# EAGLE board a3640 (EAGLE 7.7.0), part 1 of 11
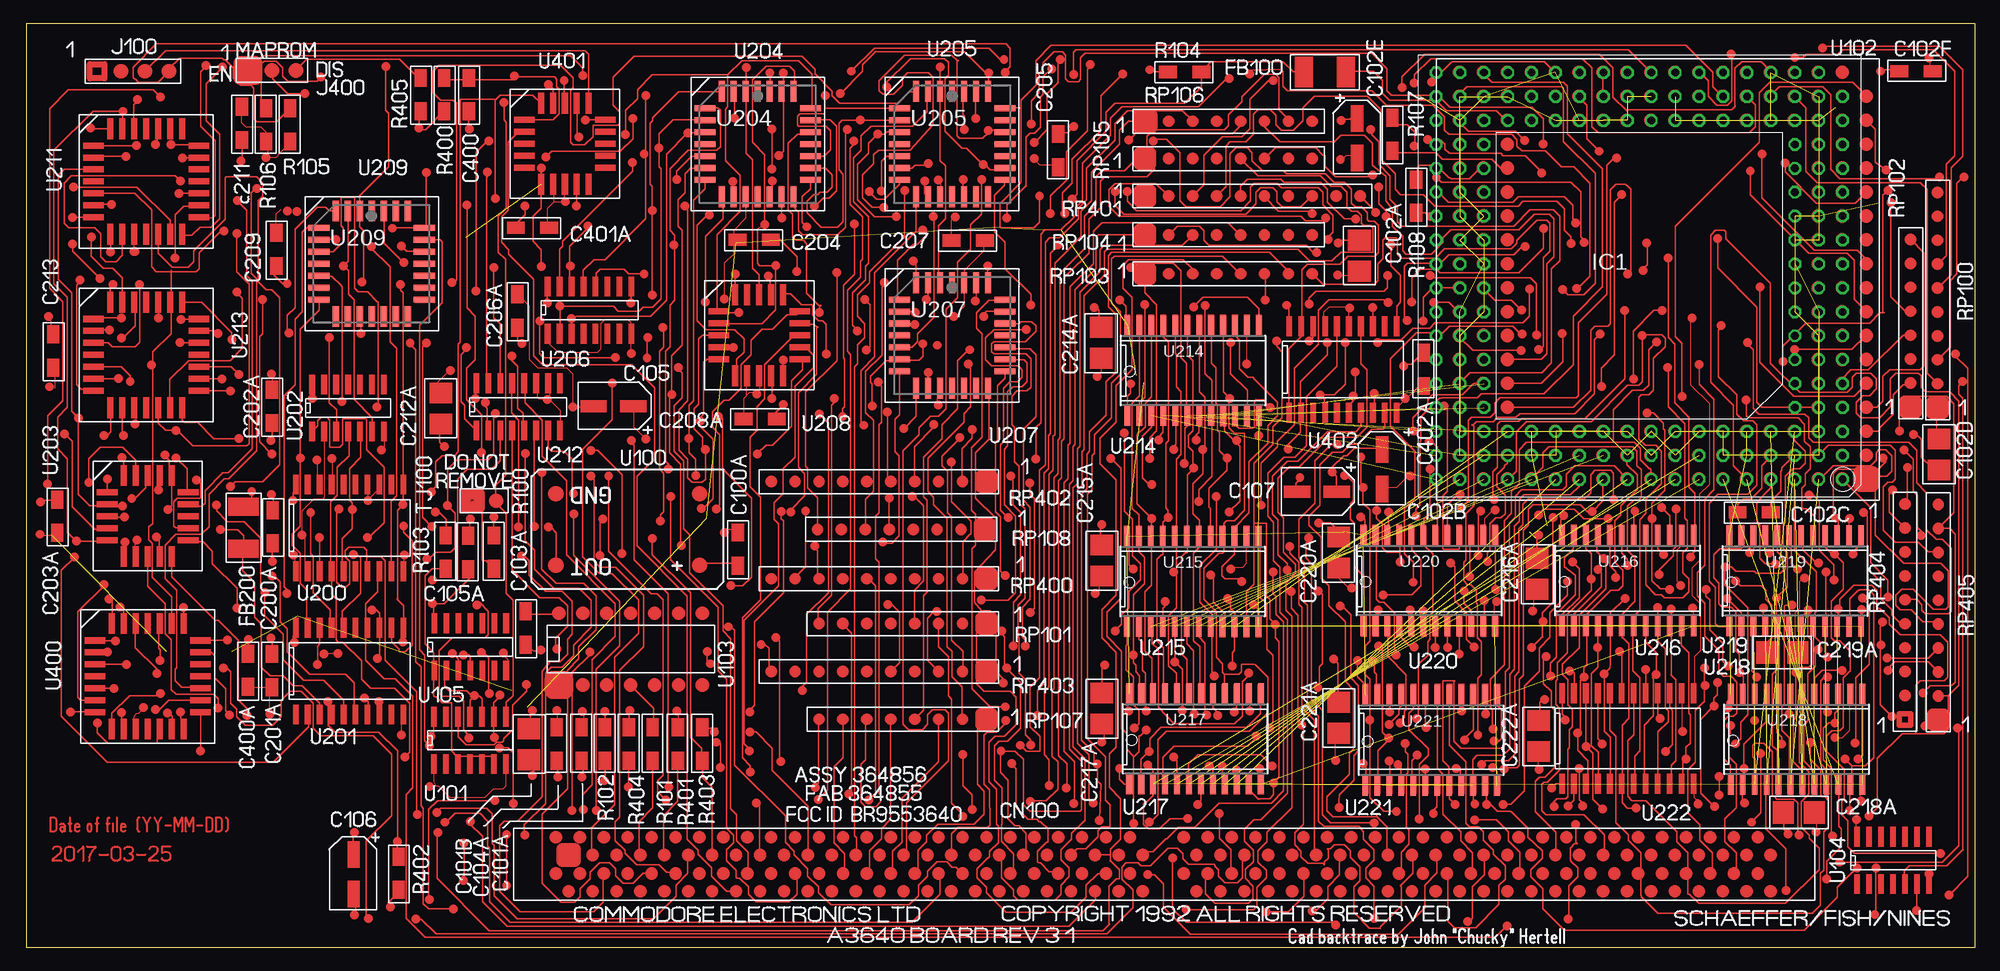
[diagram p3: board, top side]
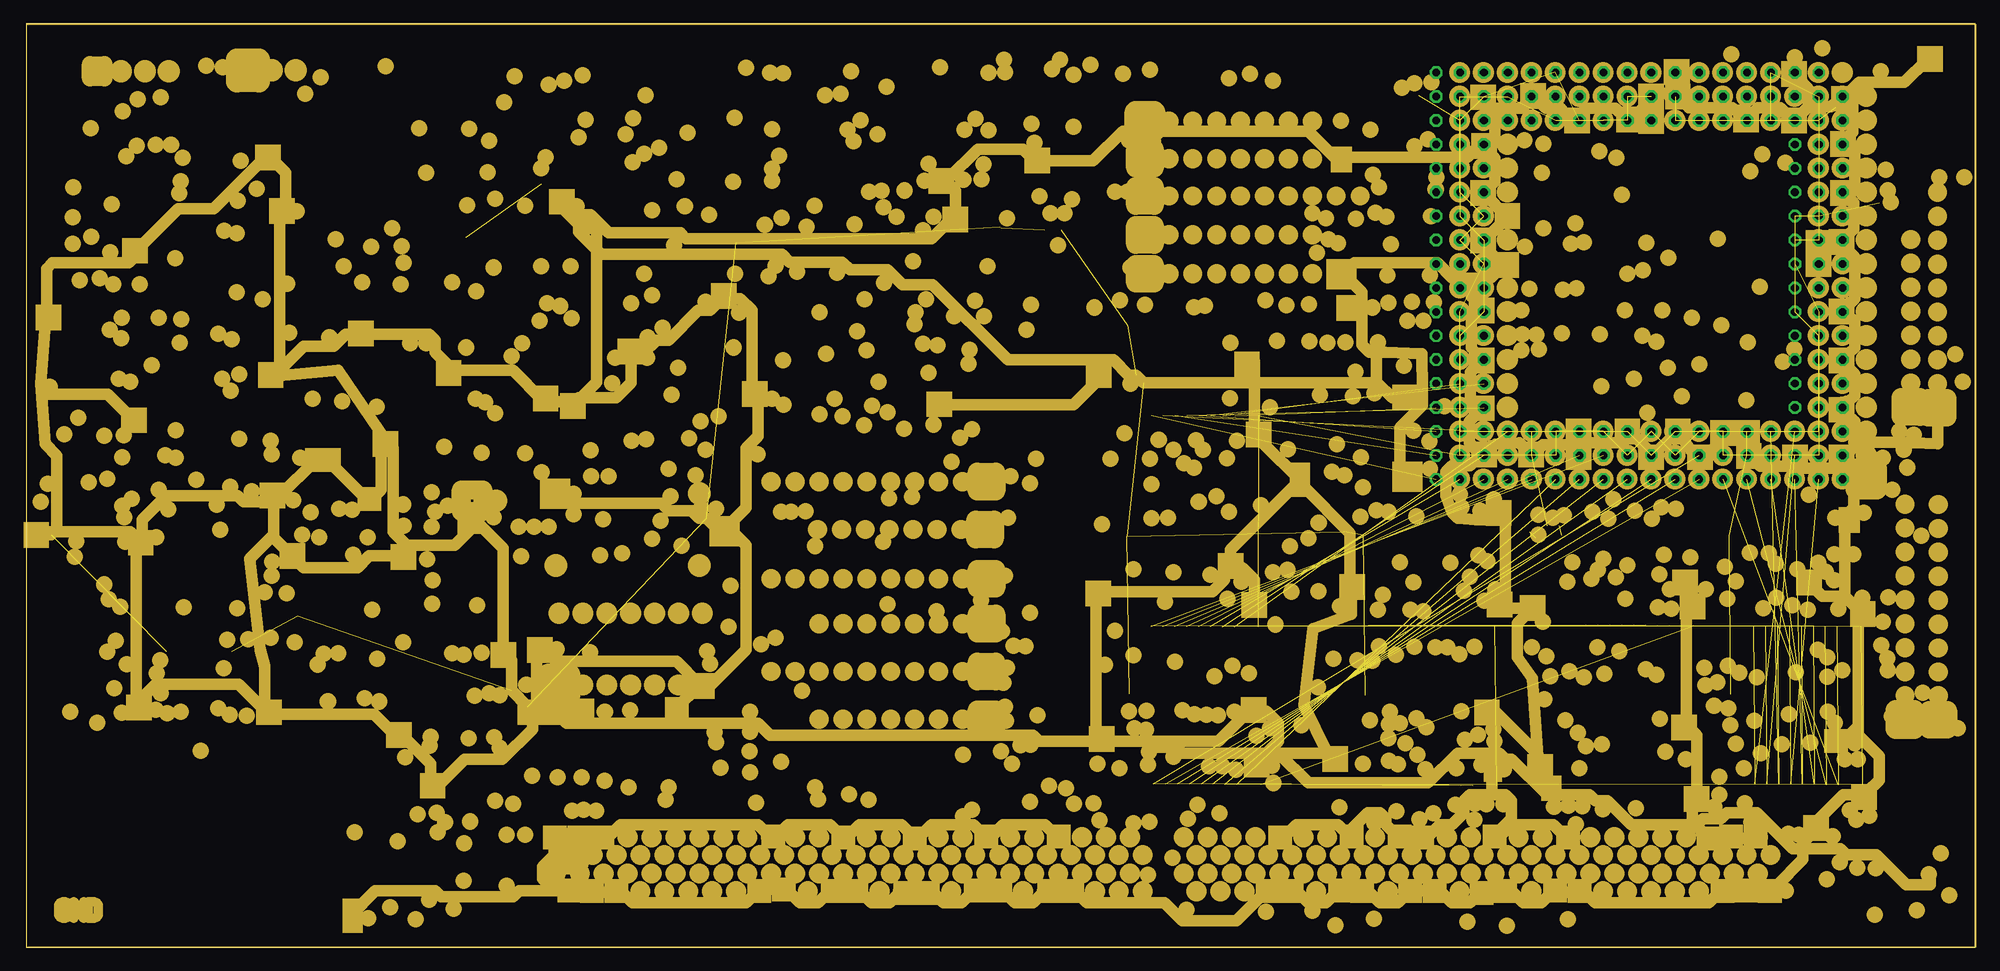
[diagram p4: board, inner layer Route2]
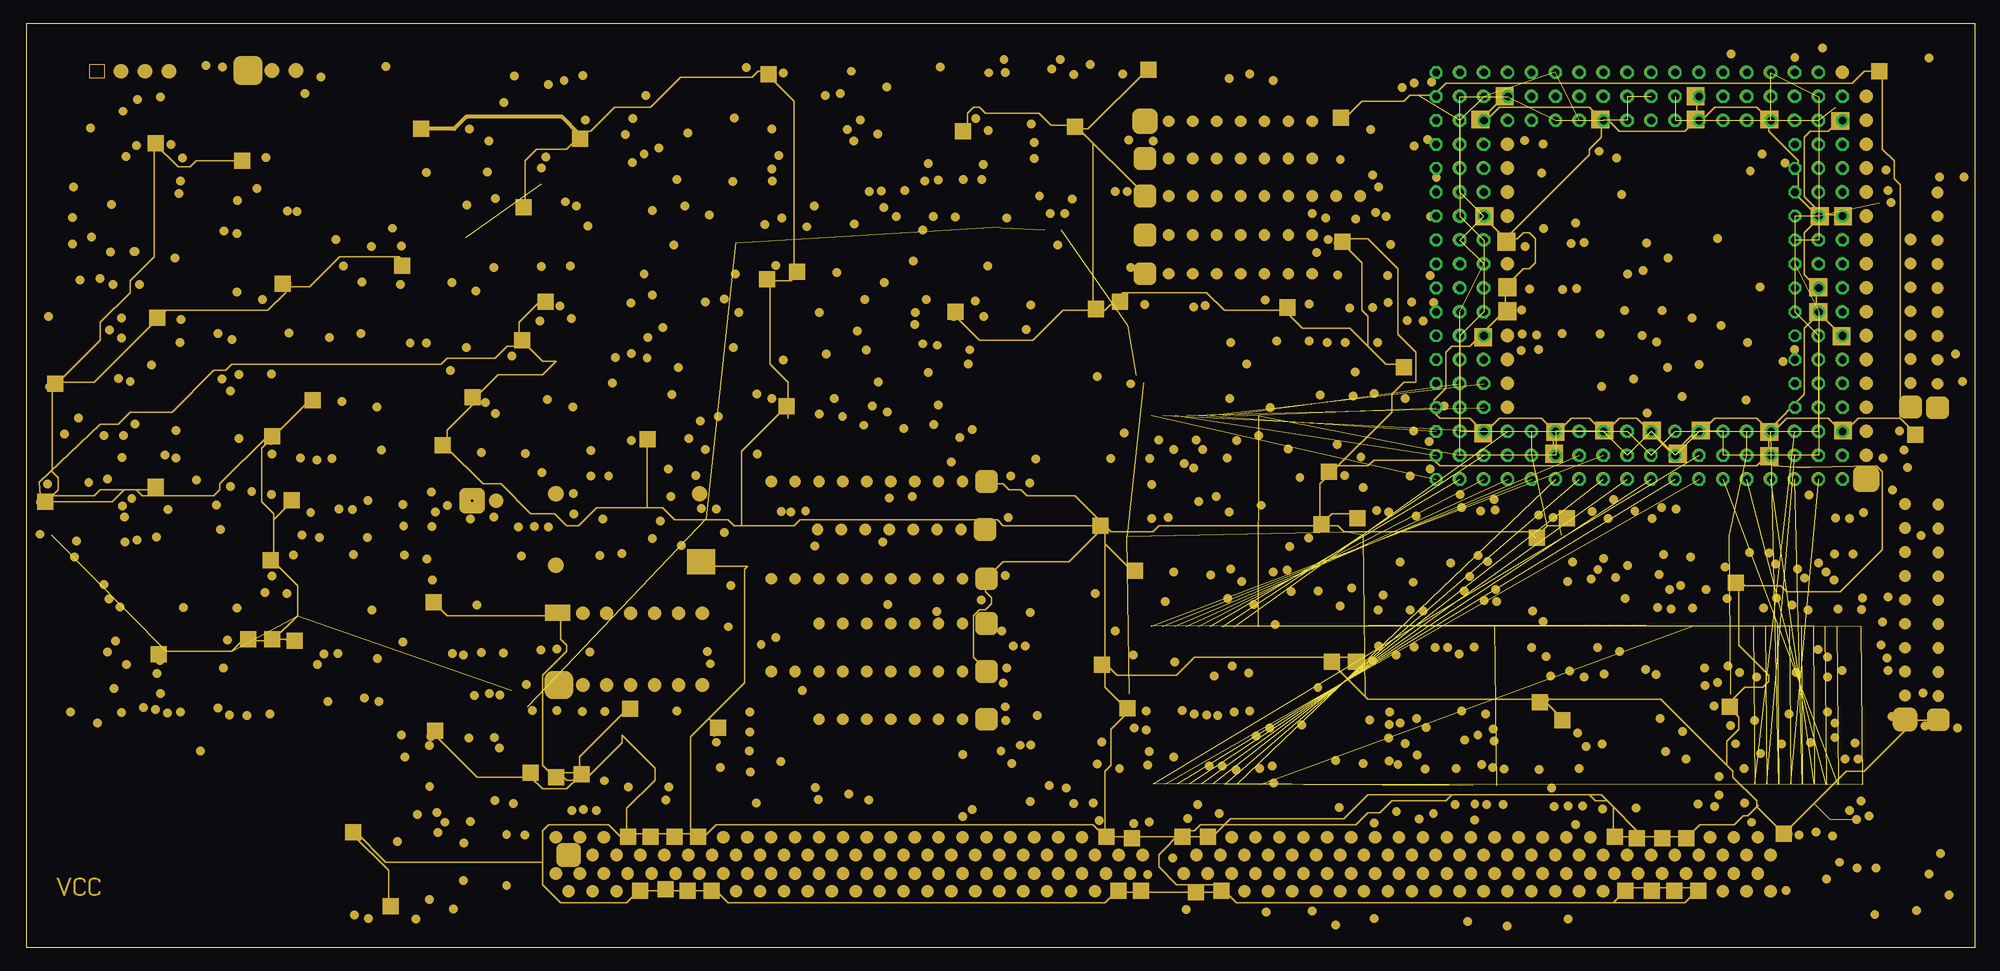
[diagram p5: board, inner layer Route15]
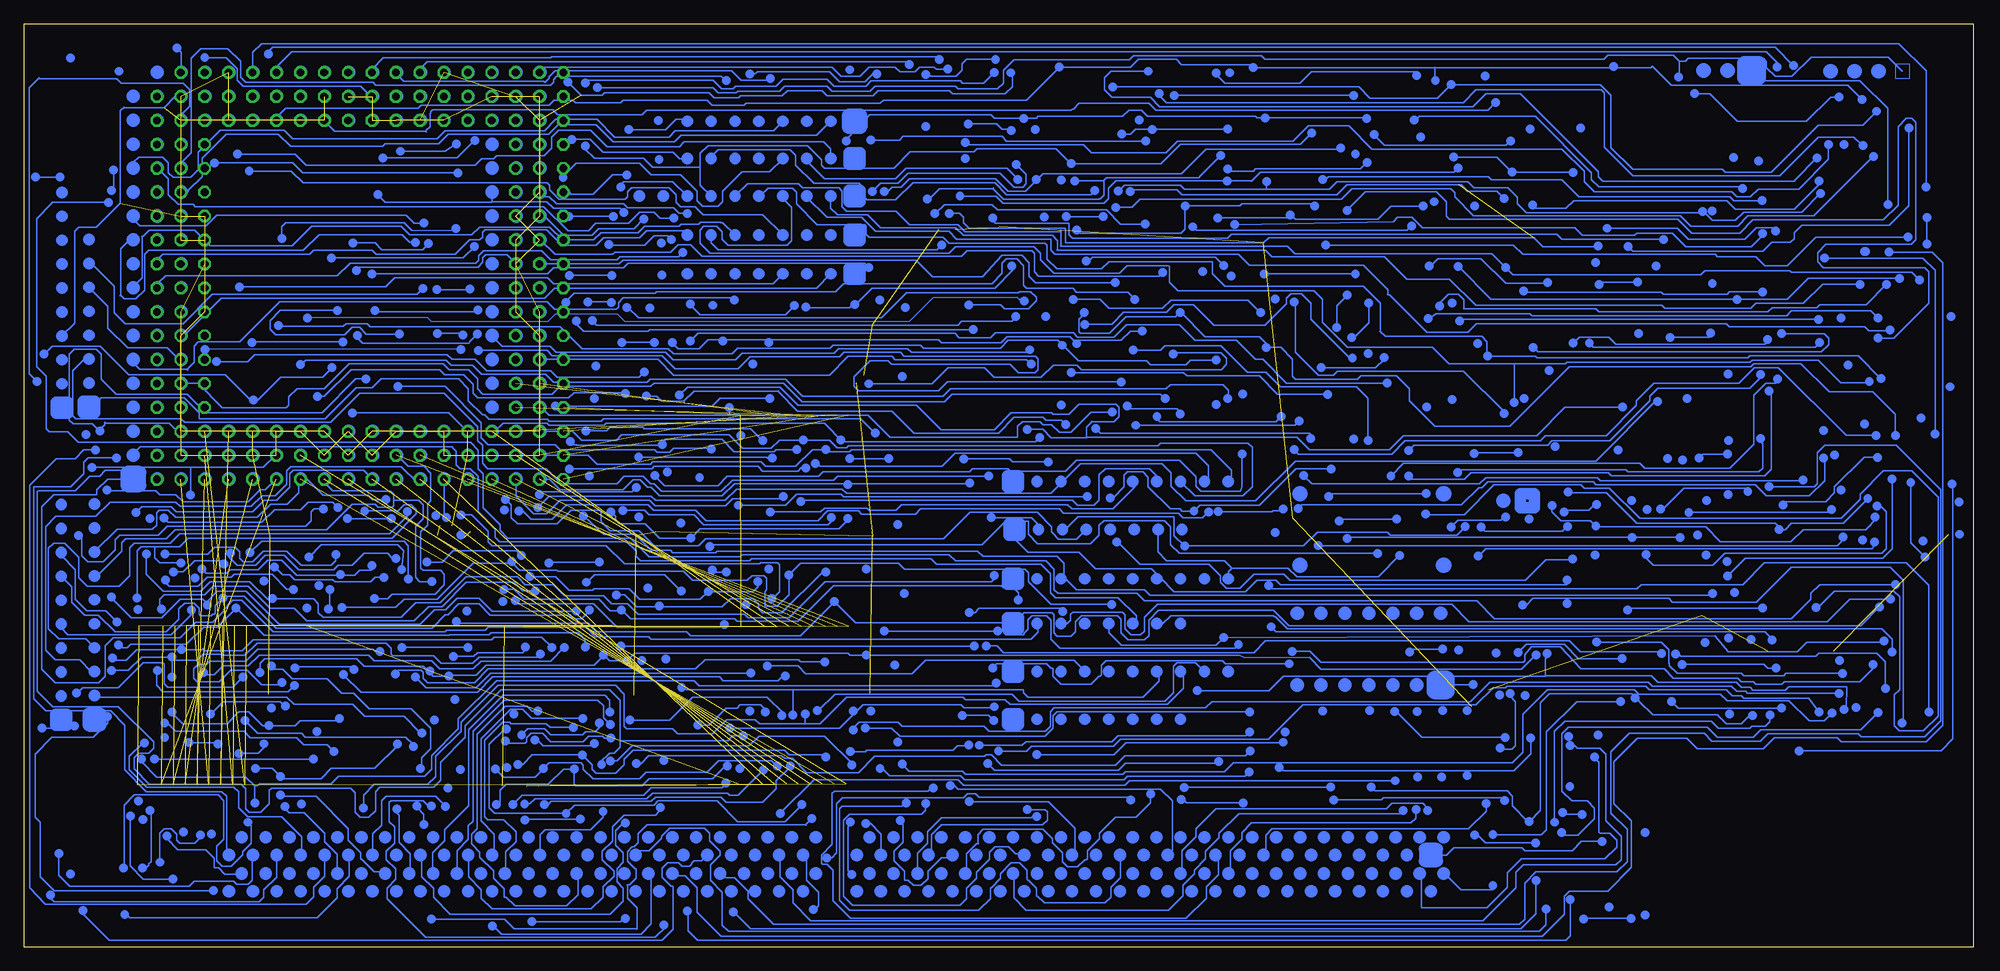
[diagram p6: board, bottom side, seen from below]

Size 207.01 x 98.04 mm. Coordinates in mm from the lower left corner, seen from the top.
Outline: 0,0 207.01,0 207.01,98.04 0,98.04 0,0
Copper layers (1*2+15*16): Top 0.035mm / dielectric 1.5mm / Route2 0.035mm / dielectric 0.15mm / Route15 0.035mm / dielectric 0.2mm / Bottom 0.035mm
Design rules "default *": minimum track width 10mil, minimum drill 24mil, track to track 8mil, track to pad 8mil, pad to pad 8mil, via to via 8mil, smd to smd 8mil, copper to edge 40mil, drill to drill 8mil, minimum pad ring 10mil, minimum via ring 8mil, stop-mask expansion 4mil, vias tented up to drill 0mil, thermal gap 10mil

## Footprints (pad centres in the part's own frame; a part is rotated, then mirrored left to right if it is on the bottom)
MPGA-179 = drill 0.813 pad 1.27 octagon: A01 21.59,-21.59; A02 19.05,-21.59; A03 16.51,-21.59; A04 13.97,-21.59; A05 11.43,-21.59; A06 8.89,-21.59; A07 6.35,-21.59; A08 3.81,-21.59; A09 1.27,-21.59; A10 -1.27,-21.59; A11 -3.81,-21.59; A12 -6.35,-21.59; A13 -8.89,-21.59; A14 -11.43,-21.59; A15 -13.97,-21.59; A16 -16.51,-21.59; A17 -19.05,-21.59; A18 -21.59,-21.59; B01 21.59,-19.05; B02 19.05,-19.05; B03 16.51,-19.05; B04 13.97,-19.05; B05 11.43,-19.05; B06 8.89,-19.05; B07 6.35,-19.05; B08 3.81,-19.05; B09 1.27,-19.05; B10 -1.27,-19.05; B11 -3.81,-19.05; B12 -6.35,-19.05; B13 -8.89,-19.05; B14 -11.43,-19.05; B15 -13.97,-19.05; B16 -16.51,-19.05; B17 -19.05,-19.05; B18 -21.59,-19.05; C01 21.59,-16.51; C02 19.05,-16.51; C03 16.51,-16.51; C04 13.97,-16.51; C05 11.43,-16.51; C06 8.89,-16.51; C07 6.35,-16.51; C08 3.81,-16.51; C09 1.27,-16.51; C10 -1.27,-16.51; C11 -3.81,-16.51; C12 -6.35,-16.51; C13 -8.89,-16.51; C14 -11.43,-16.51; C15 -13.97,-16.51; C16 -16.51,-16.51; C17 -19.05,-16.51; C18 -21.59,-16.51; D01 21.59,-13.97; D02 19.05,-13.97; D03 16.51,-13.97; D16 -16.51,-13.97; D17 -19.05,-13.97; D18 -21.59,-13.97; E01 21.59,-11.43; E02 19.05,-11.43; E03 16.51,-11.43; E16 -16.51,-11.43; E17 -19.05,-11.43; E18 -21.59,-11.43; F01 21.59,-8.89; F02 19.05,-8.89; F03 16.51,-8.89; F16 -16.51,-8.89; F17 -19.05,-8.89; F18 -21.59,-8.89; G01 21.59,-6.35; G02 19.05,-6.35; G03 16.51,-6.35; G16 -16.51,-6.35; G17 -19.05,-6.35; G18 -21.59,-6.35; H01 21.59,-3.81; H02 19.05,-3.81; H03 16.51,-3.81; H16 -16.51,-3.81; H17 -19.05,-3.81; H18 -21.59,-3.81; J01 21.59,-1.27; J02 19.05,-1.27; J03 16.51,-1.27; J16 -16.51,-1.27; J17 -19.05,-1.27; J18 -21.59,-1.27; K01 21.59,1.27; K02 19.05,1.27; K03 16.51,1.27; K16 -16.51,1.27; K17 -19.05,1.27; K18 -21.59,1.27; L01 21.59,3.81; L02 19.05,3.81; L03 16.51,3.81; L16 -16.51,3.81; L17 -19.05,3.81; L18 -21.59,3.81; M01 21.59,6.35; M02 19.05,6.35; M03 16.51,6.35; M16 -16.51,6.35; M17 -19.05,6.35; M18 -21.59,6.35; N01 21.59,8.89; N02 19.05,8.89; N03 16.51,8.89; N16 -16.51,8.89; N17 -19.05,8.89; N18 -21.59,8.89; P01 21.59,11.43; P02 19.05,11.43; P03 16.51,11.43; P16 -16.51,11.43; P17 -19.05,11.43; P18 -21.59,11.43; Q01 21.59,13.97; Q02 19.05,13.97; Q03 16.51,13.97; Q16 -16.51,13.97; Q17 -19.05,13.97; Q18 -21.59,13.97; R01 21.59,16.51; R02 19.05,16.51; R03 16.51,16.51; R04 13.97,16.51; R05 11.43,16.51; R06 8.89,16.51; R07 6.35,16.51; R08 3.81,16.51; R09 1.27,16.51; R10 -1.27,16.51; R11 -3.81,16.51; R12 -6.35,16.51; R13 -8.89,16.51; R14 -11.43,16.51; R15 -13.97,16.51; R16 -16.51,16.51; R17 -19.05,16.51; R18 -21.59,16.51; S01 21.59,19.05; S02 19.05,19.05; S03 16.51,19.05; S04 13.97,19.05; S05 11.43,19.05; S06 8.89,19.05; S07 6.35,19.05; S08 3.81,19.05; S09 1.27,19.05; S10 -1.27,19.05; S11 -3.81,19.05; S12 -6.35,19.05; S13 -8.89,19.05; S14 -11.43,19.05; S15 -13.97,19.05; S16 -16.51,19.05; S17 -19.05,19.05; S18 -21.59,19.05; T02 19.05,21.59; T03 16.51,21.59; T04 13.97,21.59; T05 11.43,21.59; T06 8.89,21.59; T07 6.35,21.59; T08 3.81,21.59; T09 1.27,21.59; T10 -1.27,21.59; T11 -3.81,21.59; T12 -6.35,21.59; T13 -8.89,21.59; T14 -11.43,21.59; T15 -13.97,21.59; T16 -16.51,21.59; T17 -19.05,21.59; T18 -21.59,21.59
GAL22V10 = smd 0.6 x 2.2: 1 0,5.6; 2 -1.27,5.6; 3 -2.54,5.6; 4 -3.81,5.6; 12 -3.81,-5.6; 13 -2.54,-5.6; 14 -1.27,-5.6; 15 0,-5.6; 16 1.27,-5.6; 17 2.54,-5.6; 18 3.81,-5.6; 26 3.81,5.6; 27 2.54,5.6; 28 1.27,5.6 | smd 2.2 x 0.6: 5 -5.6,3.81; 6 -5.6,2.54; 7 -5.6,1.27; 8 -5.6,0; 9 -5.6,-1.27; 10 -5.6,-2.54; 11 -5.6,-3.81; 19 5.6,-3.81; 20 5.6,-2.54; 21 5.6,-1.27; 22 5.6,0; 23 5.6,1.27; 24 5.6,2.54; 25 5.6,3.81
74FCT543A = smd 0.6 x 2.2: 1 -6.985,-4.775; 2 -5.715,-4.775; 3 -4.445,-4.775; 4 -3.175,-4.775; 5 -1.905,-4.775; 6 -0.635,-4.775; 7 0.635,-4.775; 8 1.905,-4.775; 9 3.175,-4.8; 10 4.445,-4.8; 11 5.715,-4.8; 12 6.985,-4.8; 13 6.985,4.8; 14 5.715,4.8; 15 4.445,4.8; 16 3.175,4.8; 17 1.905,4.8; 18 0.635,4.8; 19 -0.635,4.8; 20 -1.905,4.8; 21 -3.175,4.8; 22 -4.445,4.8; 23 -5.715,4.8; 24 -6.985,4.8

## Placement (x,y rotation side)
IC1  MC68040RC  [MPGA-179]  171.32,71.25 0 top
U204  GAL22V10  [GAL22V10]  77.67,85.24 0 top
U205  GAL22V10  [GAL22V10]  98.35,85.24 0 top
U207  GAL22V10  [GAL22V10]  98.35,64.92 0 top
U209  GAL22V10  [GAL22V10]  36.68,72.54 0 top
U214  74FCT543SOIC24  [74FCT543A]  123.93,61.21 0 top
U215  74FCT543SOIC24  [74FCT543A]  123.88,38.81 0 top
U216  74FCT543SOIC24  [74FCT543A]  170.08,38.91 0 top
U217  74FCT543SOIC24  [74FCT543A]  124.16,22.1 0 top
U218  74FCT543SOIC24  [74FCT543A]  188.01,22.05 0 top
U219  74FCT543SOIC24  [74FCT543A]  187.86,38.86 0 top
U220  74FCT543SOIC24  [74FCT543A]  149,38.91 0 top
U221  74FCT543SOIC24  [74FCT543A]  149.2,21.95 0 top

## Tracks (layer width: path | path; a pad name or v marks a point on that pad's centre or on a via)
D040_0  (3 unrouted)
D040_1  (3 unrouted)
D040_2  (3 unrouted)
D040_3  (3 unrouted)
D040_4  (3 unrouted)
D040_5  (3 unrouted)
D040_6  (3 unrouted)
D040_7  (3 unrouted)
D040_8  (2 unrouted)
D040_9  (2 unrouted)
D040_10  (2 unrouted)
D040_11  (2 unrouted)
D040_12  (2 unrouted)
D040_13  (2 unrouted)
D040_14  (2 unrouted)
D040_15  (2 unrouted)
D040_16  (2 unrouted)
D040_17  (2 unrouted)
D040_18  (2 unrouted)
D040_19  (2 unrouted)
D040_20  (2 unrouted)
D040_21  (2 unrouted)
D040_22  (2 unrouted)
D040_23  (2 unrouted)
D040_24  (1 unrouted)
D040_25  (1 unrouted)
D040_26  (1 unrouted)
D040_27  (1 unrouted)
D040_28  (1 unrouted)
D040_29  (1 unrouted)
D040_30  (1 unrouted)
D040_31  (1 unrouted)
GND  (47 unrouted)
S$1
  Top 0.64: 6.78,93.74 8.3,93.74
  Route2 0: 0.06,97.98 207.06,97.98
  Route15 0: 6.78,93.74 8.3,93.74
  Bottom 0: 6.78,93.74 8.3,93.74
S$2
  Top 0.64: 8.3,93.74 8.3,92.22
  Route2 0: 207.06,97.98 207.06,-0.02
  Route15 0: 8.3,93.74 8.3,92.22
  Bottom 0: 8.3,93.74 8.3,92.22
S$3
  Top 0.64: 8.3,92.22 6.78,92.22
  Route2 0: 207.06,-0.02 0.06,-0.02
  Route15 0: 8.3,92.22 6.78,92.22
  Bottom 0: 8.3,92.22 6.78,92.22
S$4
  Top 0.64: 6.78,92.22 6.78,93.74
  Route2 0: 0.06,-0.02 0.06,97.98
  Route15 0: 6.78,92.22 6.78,93.74
  Bottom 0: 6.78,92.22 6.78,93.74
S$5
  Top 1.52: 22.8,93.83 24.32,93.83
  Route2 0: 6.38,94.14 8.7,94.14
  Route15 1.52: 22.8,93.83 24.32,93.83
  Bottom 1.52: 22.8,93.83 24.32,93.83
S$6
  Top 1.52: 24.32,93.83 24.32,92.31
  Route2 0: 8.7,94.14 8.7,91.82
  Route15 1.52: 24.32,93.83 24.32,92.31
  Bottom 1.52: 24.32,93.83 24.32,92.31
S$7
  Top 1.52: 24.32,92.31 22.8,92.31
  Route2 0: 8.7,91.82 6.38,91.82
  Route15 1.52: 24.32,92.31 22.8,92.31
  Bottom 1.52: 24.32,92.31 22.8,92.31
S$8
  Top 1.52: 22.8,92.31 22.8,93.83
  Route2 0: 6.38,91.82 6.38,94.14
  Route15 1.52: 22.8,92.31 22.8,93.83
  Bottom 1.52: 22.8,92.31 22.8,93.83
S$9
  Top 1.52: 118.21,88.27 119.41,88.27
  Route2 2.32: 22.4,94.23 24.72,94.23
  Route15 1.52: 118.21,88.27 119.41,88.27
  Bottom 1.52: 118.21,88.27 119.41,88.27
S$10
  Top 1.52: 119.41,88.27 119.41,87.07
  Route2 2.32: 24.72,94.23 24.72,91.91
  Route15 1.52: 119.41,88.27 119.41,87.07
  Bottom 1.52: 119.41,88.27 119.41,87.07
S$11
  Top 1.52: 119.41,87.07 118.21,87.07
  Route2 2.32: 24.72,91.91 22.4,91.91
  Route15 1.52: 119.41,87.07 118.21,87.07
  Bottom 1.52: 119.41,87.07 118.21,87.07
S$12
  Top 1.52: 118.21,87.07 118.21,88.27
  Route2 2.32: 22.4,91.91 22.4,94.23
  Route15 1.52: 118.21,87.07 118.21,88.27
  Bottom 1.52: 118.21,87.07 118.21,88.27
S$13
  Top 1.2: 118.21,84.31 119.41,84.31
  Route2 2.32: 117.81,88.67 119.81,88.67
  Route15 1.2: 118.21,84.31 119.41,84.31
  Bottom 1.2: 118.21,84.31 119.41,84.31
S$14
  Top 1.2: 119.41,84.31 119.41,83.11
  Route2 2.32: 119.81,88.67 119.81,86.67
  Route15 1.2: 119.41,84.31 119.41,83.11
  Bottom 1.2: 119.41,84.31 119.41,83.11
S$15
  Top 1.2: 119.41,83.11 118.21,83.11
  Route2 2.32: 119.81,86.67 117.81,86.67
  Route15 1.2: 119.41,83.11 118.21,83.11
  Bottom 1.2: 119.41,83.11 118.21,83.11
S$16
  Top 1.2: 118.21,83.11 118.21,84.31
  Route2 2.32: 117.81,86.67 117.81,88.67
  Route15 1.2: 118.21,83.11 118.21,84.31
  Bottom 1.2: 118.21,83.11 118.21,84.31
S$17
  Top 1.2: 118.21,80.34 119.41,80.34
  Route2 2: 117.81,84.71 119.81,84.71
  Route15 1.2: 118.21,80.34 119.41,80.34
  Bottom 1.2: 118.21,80.34 119.41,80.34
S$18
  Top 1.2: 119.41,80.34 119.41,79.14
  Route2 2: 119.81,84.71 119.81,82.71
  Route15 1.2: 119.41,80.34 119.41,79.14
  Bottom 1.2: 119.41,80.34 119.41,79.14
S$19
  Top 1.2: 119.41,79.14 118.21,79.14
  Route2 2: 119.81,82.71 117.81,82.71
  Route15 1.2: 119.41,79.14 118.21,79.14
  Bottom 1.2: 119.41,79.14 118.21,79.14
S$20
  Top 1.2: 118.21,79.14 118.21,80.34
  Route2 2: 117.81,82.71 117.81,84.71
  Route15 1.2: 118.21,79.14 118.21,80.34
  Bottom 1.2: 118.21,79.14 118.21,80.34
S$21
  Top 1.2: 118.21,76.21 119.41,76.21
  Route2 2: 117.81,80.74 119.81,80.74
  Route15 1.2: 118.21,76.21 119.41,76.21
  Bottom 1.2: 118.21,76.21 119.41,76.21
S$22
  Top 1.2: 119.41,76.21 119.41,75.01
  Route2 2: 119.81,80.74 119.81,78.74
  Route15 1.2: 119.41,76.21 119.41,75.01
  Bottom 1.2: 119.41,76.21 119.41,75.01
S$23
  Top 1.2: 119.41,75.01 118.21,75.01
  Route2 2: 119.81,78.74 117.81,78.74
  Route15 1.2: 119.41,75.01 118.21,75.01
  Bottom 1.2: 119.41,75.01 118.21,75.01
S$24
  Top 1.2: 118.21,75.01 118.21,76.21
  Route2 2: 117.81,78.74 117.81,80.74
  Route15 1.2: 118.21,75.01 118.21,76.21
  Bottom 1.2: 118.21,75.01 118.21,76.21
S$25
  Top 1.2: 118.21,72.08 119.41,72.08
  Route2 2: 117.81,76.61 119.81,76.61
  Route15 1.2: 118.21,72.08 119.41,72.08
  Bottom 1.2: 118.21,72.08 119.41,72.08
S$26
  Top 1.2: 119.41,72.08 119.41,70.88
  Route2 2: 119.81,76.61 119.81,74.61
  Route15 1.2: 119.41,72.08 119.41,70.88
  Bottom 1.2: 119.41,72.08 119.41,70.88
S$27
  Top 1.2: 119.41,70.88 118.21,70.88
  Route2 2: 119.81,74.61 117.81,74.61
  Route15 1.2: 119.41,70.88 118.21,70.88
  Bottom 1.2: 119.41,70.88 118.21,70.88
S$28
  Top 1.2: 118.21,70.88 118.21,72.08
  Route2 2: 117.81,74.61 117.81,76.61
  Route15 1.2: 118.21,70.88 118.21,72.08
  Bottom 1.2: 118.21,70.88 118.21,72.08
S$29
  Top 1.2: 102.58,48.82 101.38,48.82
  Route2 2: 117.81,72.48 119.81,72.48
  Route15 1.2: 102.58,48.82 101.38,48.82
  Bottom 1.2: 102.58,48.82 101.38,48.82
S$30
  Top 1.2: 101.38,48.82 101.38,50.02
  Route2 2: 119.81,72.48 119.81,70.48
  Route15 1.2: 101.38,48.82 101.38,50.02
  Bottom 1.2: 101.38,48.82 101.38,50.02
S$31
  Top 1.2: 101.38,50.02 102.58,50.02
  Route2 2: 119.81,70.48 117.81,70.48
  Route15 1.2: 101.38,50.02 102.58,50.02
  Bottom 1.2: 101.38,50.02 102.58,50.02
S$32
  Top 1.2: 102.58,50.02 102.58,48.82
  Route2 2: 117.81,70.48 117.81,72.48
  Route15 1.2: 102.58,50.02 102.58,48.82
  Bottom 1.2: 102.58,50.02 102.58,48.82
S$33
  Top 1.2: 102.58,38.5 101.38,38.5
  Route2 2: 102.98,48.42 100.98,48.42
  Route15 1.2: 102.58,38.5 101.38,38.5
  Bottom 1.2: 102.58,38.5 101.38,38.5
S$34
  Top 1.2: 101.38,38.5 101.38,39.7
  Route2 2: 100.98,48.42 100.98,50.42
  Route15 1.2: 101.38,38.5 101.38,39.7
  Bottom 1.2: 101.38,38.5 101.38,39.7
S$35
  Top 1.2: 101.38,39.7 102.58,39.7
  Route2 2: 100.98,50.42 102.98,50.42
  Route15 1.2: 101.38,39.7 102.58,39.7
  Bottom 1.2: 101.38,39.7 102.58,39.7
S$36
  Top 1.2: 102.58,39.7 102.58,38.5
  Route2 2: 102.98,50.42 102.98,48.42
  Route15 1.2: 102.58,39.7 102.58,38.5
  Bottom 1.2: 102.58,39.7 102.58,38.5
S$37
  Top 1.2: 102.58,28.65 101.38,28.65
  Route2 2: 102.98,38.1 100.98,38.1
  Route15 1.2: 102.58,28.65 101.38,28.65
  Bottom 1.2: 102.58,28.65 101.38,28.65
S$38
  Top 1.2: 101.38,28.65 101.38,29.85
  Route2 2: 100.98,38.1 100.98,40.1
  Route15 1.2: 101.38,28.65 101.38,29.85
  Bottom 1.2: 101.38,28.65 101.38,29.85
S$39
  Top 1.2: 101.38,29.85 102.58,29.85
  Route2 2: 100.98,40.1 102.98,40.1
  Route15 1.2: 101.38,29.85 102.58,29.85
  Bottom 1.2: 101.38,29.85 102.58,29.85
S$40
  Top 1.2: 102.58,29.85 102.58,28.65
  Route2 2: 102.98,40.1 102.98,38.1
  Route15 1.2: 102.58,29.85 102.58,28.65
  Bottom 1.2: 102.58,29.85 102.58,28.65
S$41
  Top 1.2: 102.42,43.74 101.22,43.74
  Route2 2: 102.98,28.25 100.98,28.25
  Route15 1.2: 102.42,43.74 101.22,43.74
  Bottom 1.2: 102.42,43.74 101.22,43.74
S$42
  Top 1.2: 101.22,43.74 101.22,44.94
  Route2 2: 100.98,28.25 100.98,30.25
  Route15 1.2: 101.22,43.74 101.22,44.94
  Bottom 1.2: 101.22,43.74 101.22,44.94
S$43
  Top 1.2: 101.22,44.94 102.42,44.94
  Route2 2: 100.98,30.25 102.98,30.25
  Route15 1.2: 101.22,44.94 102.42,44.94
  Bottom 1.2: 101.22,44.94 102.42,44.94
S$44
  Top 1.2: 102.42,44.94 102.42,43.74
  Route2 2: 102.98,30.25 102.98,28.25
  Route15 1.2: 102.42,44.94 102.42,43.74
  Bottom 1.2: 102.42,44.94 102.42,43.74
S$45
  Top 1.2: 102.58,33.73 101.38,33.73
  Route2 2: 102.82,43.34 100.82,43.34
  Route15 1.2: 102.58,33.73 101.38,33.73
  Bottom 1.2: 102.58,33.73 101.38,33.73
S$46
  Top 1.2: 101.38,33.73 101.38,34.93
  Route2 2: 100.82,43.34 100.82,45.34
  Route15 1.2: 101.38,33.73 101.38,34.93
  Bottom 1.2: 101.38,33.73 101.38,34.93
S$47
  Top 1.2: 101.38,34.93 102.58,34.93
  Route2 2: 100.82,45.34 102.82,45.34
  Route15 1.2: 101.38,34.93 102.58,34.93
  Bottom 1.2: 101.38,34.93 102.58,34.93
S$48
  Top 1.2: 102.58,34.93 102.58,33.73
  Route2 2: 102.82,45.34 102.82,43.34
  Route15 1.2: 102.58,34.93 102.58,33.73
  Bottom 1.2: 102.58,34.93 102.58,33.73
S$49
  Top 1.2: 102.58,23.57 101.38,23.57
  Route2 2: 102.98,33.33 100.98,33.33
  Route15 1.2: 102.58,23.57 101.38,23.57
  Bottom 1.2: 102.58,23.57 101.38,23.57
S$50
  Top 1.2: 101.38,23.57 101.38,24.77
  Route2 2: 100.98,33.33 100.98,35.33
  Route15 1.2: 101.38,23.57 101.38,24.77
  Bottom 1.2: 101.38,23.57 101.38,24.77
S$51
  Top 1.2: 101.38,24.77 102.58,24.77
  Route2 2: 100.98,35.33 102.98,35.33
  Route15 1.2: 101.38,24.77 102.58,24.77
  Bottom 1.2: 101.38,24.77 102.58,24.77
S$52
  Top 1.2: 102.58,24.77 102.58,23.57
  Route2 2: 102.98,35.33 102.98,33.33
  Route15 1.2: 102.58,24.77 102.58,23.57
  Bottom 1.2: 102.58,24.77 102.58,23.57
S$53
  Top 1.6: 55.88,28.53 57.28,28.53
  Route2 2: 102.98,23.17 100.98,23.17
  Route15 1.6: 55.88,28.53 57.28,28.53
  Bottom 1.6: 55.88,28.53 57.28,28.53
S$54
  Top 1.6: 57.28,28.53 57.28,27.12
  Route2 2: 100.98,23.17 100.98,25.17
  Route15 1.6: 57.28,28.53 57.28,27.12
  Bottom 1.6: 57.28,28.53 57.28,27.12
S$55
  Top 1.6: 57.28,27.12 55.88,27.12
  Route2 2: 100.98,25.17 102.98,25.17
  Route15 1.6: 57.28,27.12 55.88,27.12
  Bottom 1.6: 57.28,27.12 55.88,27.12
S$56
  Top 1.6: 55.88,27.12 55.88,28.53
  Route2 2: 102.98,25.17 102.98,23.17
  Route15 1.6: 55.88,27.12 55.88,28.53
  Bottom 1.6: 55.88,27.12 55.88,28.53
S$57
  Top 0.6: 198.93,23.56 198.93,24.76
  Route2 2.4: 55.48,28.93 57.68,28.93
  Route15 1.4: 198.93,23.56 198.93,24.76
  Bottom 1.4: 198.93,23.56 198.93,24.76
S$58
  Top 0.6: 198.93,24.76 200.13,24.76
  Route2 2.4: 57.68,28.93 57.68,26.73
  Route15 1.4: 198.93,24.76 200.13,24.76
  Bottom 1.4: 198.93,24.76 200.13,24.76
S$59
  Top 0.6: 200.13,24.76 200.13,23.56
  Route2 2.4: 57.68,26.73 55.48,26.73
  Route15 1.4: 200.13,24.76 200.13,23.56
  Bottom 1.4: 200.13,24.76 200.13,23.56
S$60
  Top 0.6: 200.13,23.56 198.93,23.56
  Route2 2.4: 55.48,26.73 55.48,28.93
  Route15 1.4: 200.13,23.56 198.93,23.56
  Bottom 1.4: 200.13,23.56 198.93,23.56
S$61
  Top 1.2: 202.47,23.52 202.47,24.72
  Route2 2.2: 198.53,23.16 198.53,25.16
  Route15 1.2: 202.47,23.52 202.47,24.72
  Bottom 1.2: 202.47,23.52 202.47,24.72
S$62
  Top 1.2: 202.47,24.72 203.66,24.72
  Route2 2.2: 198.53,25.16 200.53,25.16
  Route15 1.2: 202.47,24.72 203.66,24.72
  Bottom 1.2: 202.47,24.72 203.66,24.72
S$63
  Top 1.2: 203.66,24.72 203.66,23.52
  Route2 2.2: 200.53,25.16 200.53,23.16
  Route15 1.2: 203.66,24.72 203.66,23.52
  Bottom 1.2: 203.66,24.72 203.66,23.52
S$64
  Top 1.2: 203.66,23.52 202.47,23.52
  Route2 2.2: 200.53,23.16 198.53,23.16
  Route15 1.2: 203.66,23.52 202.47,23.52
  Bottom 1.2: 203.66,23.52 202.47,23.52
S$65
  Top 1.2: 202.39,56.66 202.39,57.86
  Route2 2: 202.06,23.12 202.06,25.12
  Route15 1.2: 202.39,56.66 202.39,57.86
  Bottom 1.2: 202.39,56.66 202.39,57.86
S$66
  Top 1.2: 202.39,57.86 203.59,57.86
  Route2 2: 202.06,25.12 204.06,25.12
  Route15 1.2: 202.39,57.86 203.59,57.86
  Bottom 1.2: 202.39,57.86 203.59,57.86
S$67
  Top 1.2: 203.59,57.86 203.59,56.66
  Route2 2: 204.06,25.12 204.06,23.12
  Route15 1.2: 203.59,57.86 203.59,56.66
  Bottom 1.2: 203.59,57.86 203.59,56.66
S$68
  Top 1.2: 203.59,56.66 202.39,56.66
  Route2 2: 204.06,23.12 202.06,23.12
  Route15 1.2: 203.59,56.66 202.39,56.66
  Bottom 1.2: 203.59,56.66 202.39,56.66
S$69
  Top 1.2: 199.53,56.74 199.53,57.94
  Route2 2: 201.99,56.26 201.99,58.26
  Route15 1.2: 199.53,56.74 199.53,57.94
  Bottom 1.2: 199.53,56.74 199.53,57.94
S$70
  Top 1.2: 199.53,57.94 200.73,57.94
  Route2 2: 201.99,58.26 203.99,58.26
  Route15 1.2: 199.53,57.94 200.73,57.94
  Bottom 1.2: 199.53,57.94 200.73,57.94
S$71
  Top 1.2: 200.73,57.94 200.73,56.74
  Route2 2: 203.99,58.26 203.99,56.26
  Route15 1.2: 200.73,57.94 200.73,56.74
  Bottom 1.2: 200.73,57.94 200.73,56.74
S$72
  Top 1.2: 200.73,56.74 199.53,56.74
  Route2 2: 203.99,56.26 201.99,56.26
  Route15 1.2: 200.73,56.74 199.53,56.74
  Bottom 1.2: 200.73,56.74 199.53,56.74
S$73
  Top 1.2: 46.61,48.14 48.13,48.14
  Route2 2: 199.13,56.34 199.13,58.34
  Route15 1.2: 46.61,48.14 48.13,48.14
  Bottom 1.2: 46.61,48.14 48.13,48.14
S$74
  Top 1.2: 48.13,48.14 48.13,46.62
  Route2 2: 199.13,58.34 201.13,58.34
  Route15 1.2: 48.13,48.14 48.13,46.62
  Bottom 1.2: 48.13,48.14 48.13,46.62
S$75
  Top 1.2: 48.13,46.62 46.61,46.62
  Route2 2: 201.13,58.34 201.13,56.34
  Route15 1.2: 48.13,46.62 46.61,46.62
  Bottom 1.2: 48.13,46.62 46.61,46.62
S$76
  Top 1.2: 46.61,46.62 46.61,48.14
  Route2 2: 201.13,56.34 199.13,56.34
  Route15 1.2: 46.61,46.62 46.61,48.14
  Bottom 1.2: 46.61,46.62 46.61,48.14
S$77
  Top 1.4: 194.71,50.38 196.11,50.38
  Route2 2: 46.21,48.54 48.53,48.54
  Route15 1.4: 194.71,50.38 196.11,50.38
  Bottom 1.4: 194.71,50.38 196.11,50.38
S$78
  Top 1.4: 196.11,50.38 196.11,48.98
  Route2 2: 48.53,48.54 48.53,46.22
  Route15 1.4: 196.11,50.38 196.11,48.98
  Bottom 1.4: 196.11,50.38 196.11,48.98
S$79
  Top 1.4: 196.11,48.98 194.71,48.98
  Route2 2: 48.53,46.22 46.21,46.22
  Route15 1.4: 196.11,48.98 194.71,48.98
  Bottom 1.4: 196.11,48.98 194.71,48.98
S$80
  Top 1.4: 194.71,48.98 194.71,50.38
  Route2 2: 46.21,46.22 46.21,48.54
  Route15 1.4: 194.71,48.98 194.71,50.38
  Bottom 1.4: 194.71,48.98 194.71,50.38
S$81
  Top 1.3: 56.97,10.42 58.27,10.42
  Route2 2.2: 194.31,50.78 196.51,50.78
  Route15 1.3: 56.97,10.42 58.27,10.42
  Bottom 1.3: 56.97,10.42 58.27,10.42
S$82
  Top 1.3: 58.27,10.42 58.27,9.12
  Route2 2.2: 196.51,50.78 196.51,48.58
  Route15 1.3: 58.27,10.42 58.27,9.12
  Bottom 1.3: 58.27,10.42 58.27,9.12
S$83
  Top 1.3: 58.27,9.12 56.97,9.12
  Route2 2.2: 196.51,48.58 194.31,48.58
  Route15 1.3: 58.27,9.12 56.97,9.12
  Bottom 1.3: 58.27,9.12 56.97,9.12
S$84
  Top 1.3: 56.97,9.12 56.97,10.42
  Route2 2.2: 194.31,48.58 194.31,50.78
  Route15 1.3: 56.97,9.12 56.97,10.42
  Bottom 1.3: 56.97,9.12 56.97,10.42
S$85
  Top 0.15: 108.93,93.22 108.85,93.22
  Route2 2.1: 56.57,10.82 58.67,10.82
  Route15 0.222: 3.36,7.29 4.02,5.51
  Bottom 0.15: 151.83,93.42 121.19,93.42
S$86
  Top 0.15: 108.85,93.22 108.01,92.39
  Route2 2.1: 58.67,10.82 58.67,8.72
  Route15 0.222: 4.02,5.51 4.69,7.29
  Bottom 0.15: 121.19,93.42 120.24,92.46
S$87
  Top 0.15: 108.01,92.39 108.01,90.56
  Route2 2.1: 58.67,8.72 56.57,8.72
  Route15 0.222: 6.25,5.84 6.11,5.62
  Bottom 0.15: 120.24,92.46 118.25,92.46
S$88
  Top 0.15: 108.01,90.56 107.7,90.24
  Route2 2.1: 56.57,8.72 56.57,10.82
  Route15 0.222: 6.11,5.62 5.85,5.51
  Bottom 0.15: 118.25,92.46 117.3,93.42
S$89
  Top 0.15: 107.7,90.24 107.7,87.03
  Route2 1.022: 4.01,3.94 4.54,3.94
  Route15 0.222: 5.85,5.51 5.58,5.51
  Bottom 0.15: 117.3,93.42 114.52,93.42
S$90
  Top 0.15: 107.7,87.03 107.06,86.39
  Route2 1.022: 4.54,3.94 4.54,3.38
  Route15 0.222: 5.58,5.51 5.31,5.62
  Bottom 0.15: 114.52,93.42 114.01,92.9
S$91
  Top 0.15: 107.06,86.39 106.58,86.39
  Route2 1.022: 4.54,3.38 4.41,3.16
  Route15 0.222: 5.31,5.62 5.18,5.84
  Bottom 0.15: 114.01,92.9 112.42,92.9
S$92
  Top 0.15: 106.58,86.39 106.19,86
  Route2 1.022: 4.41,3.16 4.14,3.05
  Route15 0.222: 5.18,5.84 5.18,6.95
  Bottom 0.15: 112.42,92.9 111.9,93.42
S$93
  Top 0.15: 106.19,86 106.19,80.8
  Route2 1.022: 4.14,3.05 3.88,3.05
  Route15 0.222: 5.18,6.95 5.31,7.17
  Bottom 0.15: 111.9,93.42 110.36,93.42
S$94
  Top 0.15: 106.19,80.8 106.23,80.76
  Route2 1.022: 3.88,3.05 3.61,3.16
  Route15 0.222: 5.31,7.17 5.58,7.29
  Bottom 0.15: 110.36,93.42 110.12,93.18
S$95
  Top 0.15: 106.23,80.76 106.11,80.76
  Route2 1.022: 3.61,3.16 3.48,3.38
  Route15 0.222: 5.58,7.29 5.85,7.29
  Bottom 0.15: 110.12,93.18 109.16,93.18
S$96
  Top 0.15: 106.11,80.76 104.16,78.81
  Route2 1.022: 3.48,3.38 3.48,4.49
  Route15 0.222: 5.85,7.29 6.11,7.17
  Bottom 0.15: 104.16,77.38 104.16,77.14
S$97
  Top 0.15: 104.16,78.81 104.16,77.38
  Route2 1.022: 3.48,4.49 3.61,4.71
  Route15 0.222: 6.11,7.17 6.25,6.95
  Bottom 0.15: 104.16,77.14 103.85,76.83
S$98
  Top 0.15: 32.88,75.12 31.81,75.12
  Route2 1.022: 3.61,4.71 3.88,4.83
  Route15 0.222: 7.8,5.84 7.67,5.62
  Bottom 0.15: 103.85,76.83 96.11,76.83
S$99
  Top 0.15: 154.76,92.86 154.76,92.7
  Route2 1.022: 3.88,4.83 4.14,4.83
  Route15 0.222: 7.67,5.62 7.4,5.51
  Bottom 0.15: 96.11,76.83 96.07,76.79
S$100
  Top 0.15: 154.76,92.7 155.68,91.79
  Route2 1.022: 4.14,4.83 4.41,4.71
  Route15 0.222: 7.4,5.51 7.13,5.51
  Bottom 0.15: 96.07,76.79 96.07,75.64
S$101
  Top 0.15: 155.68,91.79 163.26,91.79
  Route2 1.022: 4.41,4.71 4.54,4.49
  Route15 0.222: 7.13,5.51 6.87,5.62
  Bottom 0.15: 96.07,75.64 95.67,75.24
S$102
  Top 0.15: 163.26,91.79 163.66,91.39
  Route2 1.022: 5.03,3.05 5.03,4.83
  Route15 0.222: 6.87,5.62 6.74,5.84
  Bottom 0.15: 95.67,75.24 79.24,75.24
S$103
  Top 0.15: 163.66,91.39 163.66,86.35
  Route2 1.022: 5.03,4.83 6.1,3.05
  Route15 0.222: 6.74,5.84 6.74,6.95
  Bottom 0.15: 79.24,75.24 78.8,75.68
S$104
  Top 0.15: 163.66,86.35 167.39,82.62
  Route2 1.022: 6.1,3.05 6.1,4.83
  Route15 0.222: 6.74,6.95 6.87,7.17
  Bottom 0.15: 78.8,75.68 44.24,75.68
S$105
  Top 0.15: 167.39,82.62 167.39,70.08
  Route2 1.022: 6.59,3.05 6.59,4.83
  Route15 0.222: 6.87,7.17 7.13,7.29
  Bottom 0.15: 44.24,75.68 43.68,75.12
S$106
  Top 0.15: 167.39,70.08 164.29,66.98
  Route2 1.022: 6.59,4.83 7.25,4.83
  Route15 0.222: 7.13,7.29 7.4,7.29
  Bottom 0.15: 43.68,75.12 32.88,75.12
S$107
  Top 0.15: 164.29,66.98 164.29,61.83
  Route2 1.022: 7.25,4.83 7.52,4.71
  Route15 0.222: 7.4,7.29 7.67,7.17
  Bottom 0.15: 32.88,75.12 32.84,75.16
S$108
  Top 0.15: 164.29,61.83 161.19,58.73
  Route2 1.022: 7.52,4.71 7.65,4.49
  Route15 0.222: 7.67,7.17 7.8,6.95
  Bottom 0.15: 147.62,45.75 147.54,45.75
S$109
  Top 0.15: 161.19,58.73 154.57,58.73
  Route2 1.022: 7.65,4.49 7.65,3.38
  Route15 0.15: 160.92,25.83 161.55,25.83
  Bottom 0.15: 147.54,45.75 145.44,43.81
S$110
  Top 0.15: 154.57,58.73 154.13,58.29
  Route2 1.022: 7.65,3.38 7.52,3.16
  Route15 0.15: 161.55,25.83 162.98,24.4
  Bottom 0.15: 145.44,43.81 142.15,43.81
S$111
  Top 0.15: 154.13,58.29 150.32,58.29
  Route2 1.022: 7.52,3.16 7.25,3.05
  Route15 0.15: 116.15,68.53 115.83,68.85
  Bottom 0.15: 142.15,43.81 140.44,42.1
S$112
  Top 0.15: 150.32,58.29 150.28,58.25
  Route2 1.022: 7.25,3.05 6.59,3.05
  Route15 0.15: 115.83,68.85 114.56,67.58
  Bottom 0.15: 140.44,42.1 138.37,42.1
S$113
  Top 0.15: 150.28,58.25 150.08,58.25
  Route2 1.2: 57.27,79.12 57.07,79.12
  Route15 0.15: 114.56,67.58 113.29,67.58
  Bottom 0.15: 138.37,42.1 138.14,41.86
S$114
  Top 0.15: 150.08,58.25 148.14,56.31
  Route2 1.2: 57.07,79.12 57.07,78.33
  Route15 0.15: 113.29,67.58 113.45,67.9
  Bottom 0.15: 138.14,41.86 133.57,41.86
S$115
  Top 0.15: 148.14,56.31 148.14,53.77
  Route2 1.2: 57.07,78.33 58.67,76.72
  Route15 0.15: 133.93,67.9 133.61,67.58
  Bottom 0.15: 133.57,41.86 133.41,42.02
S$116
  Top 0.15: 148.14,53.77 148.02,53.65
  Route2 1.2: 58.67,76.72 58.67,75.92
  Route15 0.15: 133.61,67.58 135.52,65.67
  Bottom 0.15: 133.41,42.02 105.75,42.02
S$117
  Top 0.15: 148.02,53.65 148.02,46.9
  Route2 1.2: 58.67,75.92 61.07,73.53
  Route15 0.15: 135.52,65.67 140.6,65.67
  Bottom 0.15: 105.75,42.02 105.2,41.47
S$118
  Top 0.15: 148.02,46.9 147.58,46.47
  Route2 1.2: 61.07,73.53 80.27,73.53
  Route15 0.15: 140.6,65.67 144.41,61.87
  Bottom 0.15: 105.2,41.47 97.3,41.47
S$119
  Top 0.15: 147.58,46.47 147.58,45.79
  Route2 1.2: 80.27,73.53 81.07,72.72
  Route15 0.15: 144.41,61.87 146.31,61.87
  Bottom 0.15: 97.3,41.47 96.58,40.75
S$120
  Top 0.15: 147.58,45.79 147.62,45.75
  Route2 1.2: 81.07,72.72 86.67,72.72
  Route15 0.15: 146.31,61.87 146.31,61.71
  Bottom 0.15: 96.58,40.75 96.58,39.57
S$121
  Top 0.15: 27.69,37.54 27.69,37.97
  Route2 1.2: 86.67,72.72 87.47,71.92
  Route15 0.15: 114.24,44.88 114.56,44.72
  Bottom 0.15: 96.58,39.57 96.9,39.26
S$122
  Top 0.15: 27.69,37.97 27.41,38.25
  Route2 1.2: 87.47,71.92 91.47,71.92
  Route15 0.15: 114.56,44.72 115.2,44.09
  Bottom 0.15: 96.9,39.26 96.6,39.26
S$123
  Top 0.15: 27.41,38.25 27.41,58.53
  Route2 1.2: 91.47,71.92 93.07,70.33
  Route15 0.15: 115.2,44.09 119.64,44.09
  Bottom 0.15: 96.6,39.26 95.27,37.93
S$124
  Top 0.15: 27.41,58.53 28.56,59.68
  Route2 1.2: 93.07,70.33 96.27,70.33
  Route15 0.15: 119.64,44.09 120.28,44.72
  Bottom 0.15: 95.27,37.93 88.05,37.93
S$125
  Top 0.15: 28.56,59.68 28.56,66.67
  Route2 1.2: 96.27,70.33 104.27,62.33
  Route15 0.15: 120.28,44.72 137.42,44.72
  Bottom 0.15: 88.05,37.93 87.45,37.34
S$126
  Top 0.15: 28.56,66.67 29.31,67.42
  Route2 1.2: 104.27,62.33 115.47,62.33
  Route15 0.15: 137.42,44.72 137.26,45.04
  Bottom 0.15: 87.45,37.34 27.88,37.34
S$127
  Top 0.15: 29.31,67.42 29.31,75.87
  Route2 1.2: 115.47,62.33 117.07,60.73
  Route15 0.15: 160.6,43.77 160.28,43.45
  Bottom 0.15: 27.88,37.34 27.69,37.54
S$128
  Top 0.15: 29.31,75.87 29.99,76.55
  Route2 1.2: 117.07,60.73 117.87,60.73
  Route15 0.15: 160.28,43.45 159.65,44.09
  Bottom 0.15: 149.25,91.83 147.86,90.44
S$130
  Top 0.15: 162.35,92.86 161.23,93.97
  Route2 1.2: 118.67,59.92 143.47,59.92
  Route15 0.15: 139.96,44.09 139.33,44.72
  Bottom 0.15: 145.6,90.44 145.36,90.68
S$131
  Top 0.15: 161.23,93.97 151.43,93.97
  Route2 1.2: 143.47,59.92 145.07,58.33
  Route15 0.15: 139.33,44.72 137.42,44.72
  Bottom 0.15: 145.36,90.68 134.25,90.68
S$132
  Top 0.15: 151.43,93.97 151.35,93.89
  Route2 1.2: 145.07,58.33 146.67,58.33
  Route15 0.15: 137.42,44.72 137.26,45.04
  Bottom 0.15: 134.25,90.68 133.73,90.16
S$133
  Top 0.15: 151.35,93.89 151.31,93.89
  Route2 1.2: 146.67,58.33 146.47,58.25
  Route15 0.15: 114.24,29.96 114.56,30.11
  Bottom 0.15: 133.73,90.16 131.11,90.16
S$134
  Top 0.15: 151.31,93.89 149.25,91.83
  Route2 1.2: 39.57,22.52 39.37,22.32
  Route15 0.15: 114.56,30.11 115.83,28.84
  Bottom 0.15: 131.11,90.16 130.91,90.36
S$135
  Top 0.15: 102.22,92.82 102.22,91.51
  Route2 1.2: 39.37,22.32 36.97,24.73
  Route15 0.15: 115.83,28.84 122.18,28.84
  Bottom 0.15: 130.91,90.36 126.51,90.36
S$136
  Top 0.15: 102.22,91.51 102.06,91.35
  Route2 1.2: 36.97,24.73 25.77,24.73
  Route15 0.15: 122.18,28.84 124.09,30.75
  Bottom 0.15: 126.51,90.36 125.95,90.92
S$137
  Top 0.15: 102.22,92.82 101.9,92.82
  Route2 1.2: 25.77,24.73 25.77,24.93
  Route15 0.15: 124.09,30.75 138.69,30.75
  Bottom 0.15: 125.95,90.92 122.26,90.92
S$138
  Top 0.15: 101.9,92.82 99.68,95.04
  Route2 1.2: 25.77,24.93 25.77,24.73
  Route15 0.15: 138.69,30.75 138.85,30.59
  Bottom 0.15: 122.26,90.92 121.75,90.4
S$139
  Top 0.15: 99.68,95.04 90.35,95.04
  Route2 1.2: 25.77,24.73 22.57,27.93
  Route15 0.15: 138.69,30.27 138.69,30.11
  Bottom 0.15: 121.75,90.4 116.78,90.4
S$140
  Top 0.15: 90.35,95.04 90.27,95.12
  Route2 1.2: 22.57,27.93 13.77,27.93
  Route15 0.15: 138.69,30.11 142.5,26.3
  Bottom 0.15: 116.78,90.4 116.78,90.44
S$141
  Top 0.15: 90.27,95.12 90.27,95.08
  Route2 1.2: 13.77,27.93 12.17,26.32
  Route15 0.15: 142.5,26.3 160.92,26.3
  Bottom 0.15: 116.78,90.44 116.31,90.92
S$142
  Top 0.15: 90.27,95.08 88.84,93.65
  Route2 1.2: 12.17,26.32 12.17,25.52
  Route15 0.15: 186.95,11.86 186.95,11.7
  Bottom 0.15: 116.31,90.92 108.73,90.92
S$143
  Top 0.15: 88.84,93.65 88.84,92.98
  Route2 1.2: 12.17,25.52 11.97,25.43
  Route15 0.15: 186.95,11.7 183.78,14.88
  Bottom 0.15: 108.73,90.92 108.41,90.6
S$144
  Top 0.15: 88.84,92.98 86.46,90.6
  Route2 1.2: 58.07,57.42 57.87,57.52
  Route15 0.15: 183.78,14.88 183.78,15.51
  Bottom 0.15: 108.41,90.6 102.81,90.6
S$145
  Top 0.15: 11.73,85.08 7.84,85.08
  Route2 1.2: 57.87,57.52 58.67,58.33
  Route15 0.15: 183.78,15.51 181.24,18.05
  Bottom 0.15: 102.81,90.6 102.06,91.35
S$146
  Top 0.15: 7.84,85.08 7.8,85.12
  Route2 1.2: 58.67,58.33 62.67,58.33
  Route15 0.15: 181.24,18.05 181.24,18.68
  Bottom 0.15: 102.06,91.35 102.06,92.66
S$147
  Top 0.15: 113.01,93.69 113.01,93.5
  Route2 1.2: 62.67,58.33 64.27,59.92
  Route15 0.15: 181.24,18.68 173.62,26.3
  Bottom 0.15: 102.06,92.66 102.22,92.82
S$148
  Top 0.15: 113.01,93.5 112.74,93.22
  Route2 1.2: 64.27,59.92 64.27,63.12
  Route15 0.15: 173.62,26.3 160.92,26.3
  Bottom 0.15: 86.46,90.6 86.46,90.44
S$149
  Top 0.15: 112.74,93.22 112.74,86.67
  Route2 1.2: 64.27,63.12 64.27,63.02
  Route15 0.15: 186.63,12.02 186.95,11.7
  Bottom 0.15: 86.46,90.44 85.67,89.65
S$150
  Top 0.15: 112.74,86.67 110.47,84.41
  Route2 1.2: 43.17,17.12 43.37,16.73
  Route15 0.15: 186.95,11.7 183.78,14.88
  Bottom 0.15: 85.67,89.65 54.16,89.65
S$151
  Top 0.15: 110.47,84.41 110.47,81.43
  Route2 1.2: 43.37,16.73 46.57,19.93
  Route15 0.15: 183.78,14.88 183.78,15.51
  Bottom 0.15: 54.16,89.65 52.81,91
S$152
  Top 0.15: 110.47,81.43 108.81,79.76
  Route2 1.2: 46.57,19.93 50.57,19.93
  Route15 0.15: 183.78,15.51 181.24,18.05
  Bottom 0.15: 52.81,91 39.51,91
S$153
  Top 0.15: 108.81,79.76 108.81,77.94
  Route2 1.2: 50.57,19.93 53.77,23.12
  Route15 0.15: 181.24,18.05 181.24,18.68
  Bottom 0.15: 39.51,91 39.2,90.68
S$154
  Top 0.15: 108.81,77.94 108.77,77.9
  Route2 1.2: 53.77,23.12 53.77,24.73
  Route15 0.15: 181.24,18.68 180.6,19.32
  Bottom 0.15: 39.2,90.68 39.2,84.92
S$155
  Top 0.15: 39.87,74.41 39.87,74.37
  Route2 1.2: 53.77,24.73 53.57,24.93
  Route15 0.15: 180.6,19.32 180.6,21.86
  Bottom 0.15: 39.2,84.92 36.18,81.91
S$156
  Top 0.15: 39.87,74.37 40.39,73.85
  Route2 1.2: 53.67,24.93 53.87,24.73
  Route15 0.15: 180.6,21.86 181.87,23.13
  Bottom 0.15: 36.18,81.91 20.58,81.91
S$157
  Top 0.15: 40.39,73.85 41.7,73.85
  Route2 1.2: 53.87,24.73 56.27,24.73
  Route15 0.15: 181.87,23.13 181.87,24.4
  Bottom 0.15: 20.58,81.91 16.49,86
S$158
  Top 0.15: 41.7,73.85 41.73,73.81
  Route2 1.2: 56.27,24.73 56.37,24.93
  Route15 0.15: 181.87,24.4 180.6,25.67
  Bottom 0.15: 16.49,86 12.68,86
S$159
  Top 0.15: 167.47,90.32 167.47,92.86
  Route2 1.2: 58.97,25.02 59.37,24.73
  Route15 0.15: 180.6,25.67 180.76,25.35
  Bottom 0.15: 12.68,86 11.93,85.24
S$160
  Top 0.15: 127.74,92.23 127.5,92.23
  Route2 1.2: 59.37,24.73 56.17,24.73
  Route15 0.15: 117.1,25.04 114.56,27.57
  Bottom 0.15: 164.93,92.86 164.93,93.26
S$161
  Top 0.15: 127.5,92.23 124.48,89.21
  Route2 1.2: 56.17,24.73 56.27,24.93
  Route15 0.15: 114.56,27.57 114.56,30.11
  Bottom 0.15: 164.93,93.26 164.21,93.97
S$162
  Top 0.15: 124.48,89.21 116.39,89.21
  Route2 1.2: 47.17,45.23 47.47,45.52
  Route15 0.15: 114.56,30.11 114.24,29.96
  Bottom 0.15: 164.21,93.97 113.29,93.97
S$163
  Top 0.15: 116.39,89.21 115.16,87.98
  Route2 1.2: 47.47,45.52 50.67,42.33
  Route15 0.15: 117.74,39.96 117.74,39.64
  Bottom 0.15: 113.29,93.97 113.01,93.69
S$164
  Top 0.15: 115.16,87.98 115.16,86.19
  Route2 1.2: 50.67,42.33 50.67,31.12
  Route15 0.15: 117.74,39.64 114.56,42.81
  Bottom 0.15: 108.77,77.9 107.66,77.9
S$165
  Top 0.15: 115.16,86.19 112.18,83.22
  Route2 1.2: 50.67,31.12 50.77,31.02
  Route15 0.15: 114.56,42.81 114.56,44.72
  Bottom 0.15: 107.66,77.9 107.26,77.5
S$166
  Top 0.15: 112.18,83.22 112.18,79.25
  Route2 1.2: 71.77,27.73 71.47,27.93
  Route15 0.15: 114.56,44.72 114.24,44.88
  Bottom 0.15: 107.26,77.5 107.26,76.91
S$167
  Top 0.15: 112.18,79.25 111.43,78.49
  Route2 1.2: 71.47,27.93 69.07,30.32
  Route15 0.15: 137.26,45.04 137.42,44.72
  Bottom 0.15: 107.26,76.91 106.66,76.31
S$168
  Top 0.15: 111.43,78.49 111.43,77.7
  Route2 1.2: 69.07,30.32 56.27,30.32
  Route15 0.15: 137.42,44.72 138.69,45.99
  Bottom 0.15: 106.66,76.31 96.42,76.31
S$169
  Top 0.15: 111.43,77.7 111.27,77.54
  Route2 1.2: 56.27,30.32 55.47,31.12
  Route15 0.15: 138.69,45.99 141.87,45.99
  Bottom 0.15: 96.42,76.31 96.42,74.8
S$170
  Top 0.15: 111.27,77.54 111.27,77.5
  Route2 1.2: 55.47,31.12 54.67,31.12
  Route15 0.15: 141.87,45.99 141.71,45.67
  Bottom 0.15: 96.42,74.8 96.39,74.76
S$171
  Top 0.15: 111.27,77.5 109.92,76.15
  Route2 1.2: 54.67,31.12 54.57,31.52
  Route15 0.15: 160.44,43.45 160.28,43.45
  Bottom 0.15: 96.39,74.76 75.39,74.76
S$174
  Top 0.15: 108.17,76.07 107.78,75.68
  Route2 1.2: 72.27,45.52 71.47,45.52
  Route15 0.15: 162.82,44.72 163.46,45.35
  Bottom 0.15: 46.66,75.32 45.7,74.37
S$175
  Top 0.15: 107.78,75.68 107.78,55.67
  Route2 1.2: 71.47,45.52 70.67,46.33
  Route15 0.15: 163.46,45.35 163.46,45.99
  Bottom 0.15: 45.7,74.37 39.91,74.37
S$176
  Top 0.15: 107.78,55.67 107.26,55.16
  Route2 1.2: 70.67,46.33 68.27,46.33
  Route15 0.15: 163.46,45.99 163.3,45.83
  Bottom 0.15: 39.91,74.37 39.87,74.41
S$177
  Top 0.15: 107.26,55.16 107.26,51.86
  Route2 1.2: 68.27,46.33 67.47,47.12
  Route15 0.15: 180.76,25.35 180.6,25.67
  Bottom 0.15: 167.47,92.86 167.47,92.66
S$178
  Top 0.15: 107.26,51.86 107.22,51.82
  Route2 1.2: 67.47,47.12 57.87,47.12
  Route15 0.15: 180.6,25.67 182.51,27.57
  Bottom 0.15: 167.47,92.66 166.71,91.91
S$179
  Top 0.15: 98.25,51.51 98.25,47.3
  Route2 1.2: 57.87,47.12 57.07,47.92
  Route15 0.15: 182.51,27.57 184.41,27.57
  Bottom 0.15: 166.71,91.91 151.83,91.91
S$180
  Top 0.15: 98.25,47.3 100.35,45.2
  Route2 1.2: 57.07,47.92 56.27,47.92
  Route15 0.15: 184.41,27.57 185.05,28.21
  Bottom 0.15: 151.83,91.91 151.75,91.83
S$181
  Top 0.15: 100.35,45.2 100.35,43.81
  Route2 1.2: 56.27,47.92 56.17,48.12
  Route15 0.15: 185.05,28.21 185.05,28.84
  Bottom 0.15: 151.75,91.83 151.67,91.83
S$182
  Top 0.15: 100.35,43.81 100.23,43.81
  Route2 1.2: 139.67,71.33 139.47,71.03
  Route15 0.15: 185.05,28.84 181.87,32.02
  Bottom 0.15: 151.67,91.83 151.27,92.23
S$183
  Top 0.15: 100.23,43.81 99.48,43.05
  Route2 1.2: 139.47,71.03 141.07,72.62
  Route15 0.15: 181.87,32.02 181.87,38.37
  Bottom 0.15: 151.27,92.23 151.27,92.39
S$184
  Top 0.15: 99.48,43.05 99.48,39.3
  Route2 1.2: 141.07,72.62 149.87,72.62
  Route15 0.15: 181.87,38.37 181.55,38.69
  Bottom 0.15: 151.27,92.39 150.64,93.02
S$185
  Top 0.15: 99.48,39.3 99.44,39.26
  Route2 1.2: 149.87,72.62 151.47,71.03
  Route15 0.15: 99.64,86.79 99.32,86.63
  Bottom 0.15: 150.64,93.02 131.87,93.02
S$186
  Top 0.15: 109.8,94.21 109.8,94.01
  Route2 1.2: 151.47,71.03 155.47,71.03
  Route15 0.15: 99.32,86.63 99.96,87.27
  Bottom 0.15: 131.87,93.02 130.87,92.03
S$187
  Top 0.15: 109.8,94.01 109.56,93.77
  Route2 1.2: 155.47,71.03 157.07,72.62
  Route15 0.15: 99.96,87.27 99.96,88.53
  Bottom 0.15: 130.87,92.03 127.94,92.03
S$188
  Top 0.15: 109.56,93.77 109.56,91.75
  Route2 1.2: 157.07,72.62 157.31,72.44
  Route15 0.15: 99.96,88.53 100.59,89.17
  Bottom 0.15: 127.94,92.03 127.74,92.23
S$189
  Top 0.15: 109.56,91.75 108.41,90.6
  Route2 1.2: 146.67,49.92 146.67,50.33
  Route15 0.15: 100.59,89.17 101.23,89.17
  Bottom 0.15: 107.22,51.82 102.34,51.82
S$190
  Top 0.15: 108.41,90.6 108.41,86.75
  Route2 1.2: 146.67,50.33 145.87,51.12
  Route15 0.15: 101.23,89.17 101.86,88.53
  Bottom 0.15: 102.34,51.82 102.02,51.51
S$191
  Top 0.15: 108.41,86.75 107.06,85.4
  Route2 1.2: 145.87,51.12 145.87,55.12
  Route15 0.15: 101.86,88.53 107.58,88.53
  Bottom 0.15: 102.02,51.51 98.25,51.51
S$192
  Top 0.15: 15.38,85.2 17.49,85.2
  Route2 1.2: 145.87,55.12 148.27,57.52
  Route15 0.15: 107.58,88.53 108.85,87.27
  Bottom 0.15: 98.25,51.51 98.17,51.59
S$193
  Top 0.15: 17.49,85.2 17.68,85
  Route2 1.2: 148.27,57.52 148.27,59.12
  Route15 0.15: 108.85,87.27 111.39,87.27
  Bottom 0.15: 170,92.86 170,93.26
S$194
  Top 0.15: 172.54,92.86 170.12,95.28
  Route2 1.2: 148.27,59.12 148.22,62.98
  Route15 0.15: 111.39,87.27 111.23,87.11
  Bottom 0.15: 170,93.26 168.85,94.41
S$195
  Top 0.15: 170.12,95.28 111.51,95.28
  Route2 1.2: 148.22,62.98 144.27,63.12
  Route15 0.15: 154.76,87.78 154.57,87.9
  Bottom 0.15: 168.85,94.41 151.11,94.41
S$196
  Top 0.15: 111.51,95.28 111.23,95
  Route2 1.2: 144.27,63.12 142.67,63.12
  Route15 0.15: 154.57,87.9 157.11,90.44
  Bottom 0.15: 151.11,94.41 151,94.53
S$197
  Top 0.15: 111.23,95 111.23,92.62
  Route2 1.2: 142.67,63.12 141.87,63.92
  Route15 0.15: 157.11,90.44 157.31,90.32
  Bottom 0.15: 151,94.53 110.12,94.53
S$198
  Top 0.15: 111.23,92.62 111.27,92.58
  Route2 1.2: 141.87,63.92 141.87,69.53
  Route15 0.15: 167.47,87.78 167.27,87.9
  Bottom 0.15: 110.12,94.53 109.8,94.21
S$199
  Top 0.15: 103.85,94.21 103.49,94.21
  Route2 1.2: 141.87,69.53 140.27,71.12
  Route15 0.15: 167.27,87.9 166,89.17
  Bottom 0.15: 107.06,85.4 106.86,85.4
S$200
  Top 0.15: 103.49,94.21 102.26,95.44
  Route2 1.2: 140.27,71.12 139.47,71.12
  Route15 0.15: 166,89.17 156.47,89.17
  Bottom 0.15: 106.86,85.4 106.62,85.16
S$201
  Top 0.15: 102.26,95.44 90.08,95.44
  Route2 1.2: 139.47,71.12 139.67,71.42
  Route15 0.15: 156.47,89.17 155.2,87.9
  Bottom 0.15: 106.62,85.16 94.48,85.16
S$202
  Top 0.15: 90.08,95.44 87.61,92.98
  Route2 1.2: 139.67,83.53 139.47,83.83
  Route15 0.15: 155.2,87.9 154.57,87.9
  Bottom 0.15: 94.48,85.16 93.65,84.33
S$203
  Top 0.15: 16.61,83.77 18,83.77
  Route2 1.2: 139.47,83.83 153.07,83.83
  Route15 0.15: 154.57,87.9 154.76,87.78
  Bottom 0.15: 93.65,84.33 85.75,84.33
S$204
  Top 0.15: 18,83.77 18.04,83.81
  Route2 1.2: 153.07,83.83 153.87,84.62
  Route15 0.15: 177.62,87.78 177.43,87.9
  Bottom 0.15: 85.75,84.33 84.52,85.56
S$205
  Top 0.15: 177.62,92.86 177.71,92.86
  Route2 1.2: 153.87,84.62 154.67,84.62
  Route15 0.15: 177.43,87.9 176.16,86.63
  Bottom 0.15: 84.52,85.56 72.25,85.56
S$206
  Top 0.15: 177.71,92.86 178.62,91.95
  Route2 1.2: 154.67,84.62 154.84,85.02
  Route15 0.15: 176.16,86.63 169.17,86.63
  Bottom 0.15: 72.25,85.56 70.63,87.19
S$207
  Top 0.15: 178.62,91.95 178.62,90.32
  Route2 1.2: 202.19,94.27 201.87,94.22
  Route15 0.15: 169.17,86.63 167.9,87.9
  Bottom 0.15: 70.63,87.19 66.34,87.19
S$208
  Top 0.15: 178.62,90.32 179.57,89.37
  Route2 1.2: 201.87,94.22 199.47,91.83
  Route15 0.15: 167.9,87.9 167.27,87.9
  Bottom 0.15: 66.34,87.19 63.88,84.72
S$209
  Top 0.15: 179.57,89.37 180.64,89.37
  Route2 1.2: 199.47,91.83 194.67,91.83
  Route15 0.15: 167.27,87.9 167.47,87.78
  Bottom 0.15: 63.88,84.72 43.68,84.72
S$210
  Top 0.15: 180.64,89.37 181.12,89.84
  Route2 1.2: 194.67,91.83 193.07,90.22
  Route15 0.15: 177.62,87.78 177.43,87.9
  Bottom 0.15: 43.68,84.72 41.3,82.34
S$211
  Top 0.15: 181.12,89.84 181.12,94.77
  Route2 1.2: 193.07,90.22 193.06,90.06
  Route15 0.15: 177.43,87.9 177.43,90.44
  Bottom 0.15: 41.3,82.34 41.3,81.23
S$212
  Top 0.15: 181.12,94.77 181.08,94.81
  Route2 1.2: 107.37,83.53 107.47,83.92
  Route15 0.15: 177.43,90.44 177.62,90.32
  Bottom 0.15: 41.3,81.23 40.27,80.2
S$213
  Top 0.15: 19.11,93.58 19.11,93.5
  Route2 1.2: 107.47,83.92 106.67,83.92
  Route15 0.15: 185.25,87.78 185.05,87.9
  Bottom 0.15: 40.27,80.2 25.66,80.2
S$214
  Top 0.15: 19.11,93.5 18.56,92.94
  Route2 1.2: 106.67,83.92 105.87,84.72
  Route15 0.15: 185.05,87.9 183.78,89.17
  Bottom 0.15: 25.66,80.2 25.11,79.64
S$215
  Top 0.15: 18.56,92.94 18.56,87.15
  Route2 1.2: 105.87,84.72 101.07,84.72
  Route15 0.15: 183.78,89.17 179.33,89.17
  Bottom 0.15: 25.11,79.64 23.68,79.64
S$216
  Top 0.15: 18.56,87.15 20.11,85.6
  Route2 1.2: 101.07,84.72 97.87,81.53
  Route15 0.15: 179.33,89.17 178.06,87.9
  Bottom 0.15: 23.68,79.64 22.84,80.48
S$217
  Top 0.15: 20.11,85.6 20.11,77.7
  Route2 1.2: 97.87,81.53 97.07,81.53
  Route15 0.15: 178.06,87.9 177.43,87.9
  Bottom 0.15: 22.84,80.48 18.52,80.48
S$218
  Top 0.15: 20.11,77.7 19.83,77.42
  Route2 1.2: 97.07,81.53 97.17,81.33
  Route15 0.15: 177.43,87.9 177.62,87.78
  Bottom 0.15: 18.52,80.48 15.38,83.61
S$219
  Top 0.15: 19.83,77.42 19.27,77.38
  Route2 1.2: 143.37,59.92 143.37,63.12
  Route15 0.15: 190.33,77.62 190.13,77.74
  Bottom 0.15: 15.38,83.61 15.38,85.2
S$220
  Top 0.15: 20.86,93.42 19.11,91.67
  Route2 1.2: 141.87,67.53 141.37,67.53
  Route15 0.15: 190.13,77.74 188.22,79.64
  Bottom 0.15: 15.38,85.2 15.46,85.28
S$221
  Top 0.15: 19.11,91.67 19.11,87.74
  Route2 1.2: 156.27,73.03 156.17,73.03
  Route15 0.15: 188.22,79.64 188.22,83.45
  Bottom 0.15: 111.23,92.62 110.91,92.62
S$222
  Top 0.15: 19.11,87.74 20.54,86.31
  Route2 1.2: 156.17,73.03 155.17,74.03
  Route15 0.15: 188.22,83.45 185.05,86.63
  Bottom 0.15: 110.91,92.62 110.71,92.42
S$223
  Top 0.15: 20.54,86.31 20.54,77.3
  Route2 1.2: 155.47,75.72 155.57,75.72
  Route15 0.15: 185.05,86.63 185.05,87.9
  Bottom 0.15: 110.71,92.42 108.05,92.42
S$224
  Top 0.15: 20.54,77.3 19.67,76.43
  Route2 1.2: 155.57,75.72 156.67,76.83
  Route15 0.15: 185.05,87.9 185.25,87.78
  Bottom 0.15: 108.05,92.42 107.42,93.06
S$225
  Top 0.15: 19.67,76.43 18.48,76.43
  Route2 1.2: 156.67,78.22 156.57,78.22
  Route15 0.15: 192.65,87.7 192.67,87.9
  Bottom 0.15: 107.42,93.06 107.42,93.77
S$226
  Top 0.15: 18.48,76.43 17.61,75.56
  Route2 1.2: 156.57,78.22 155.47,79.33
  Route15 0.15: 192.67,87.9 191.4,86.63
  Bottom 0.15: 107.42,93.77 106.94,94.25
S$227
  Top 0.15: 17.61,75.56 16.7,75.56
  Route2 1.2: 153.87,68.42 153.87,68.62
  Route15 0.15: 191.4,86.63 189.49,86.63
  Bottom 0.15: 106.94,94.25 103.89,94.25
S$228
  Top 0.15: 16.7,75.56 16.57,75.68
  Route2 1.2: 153.87,68.62 153.47,69.03
  Route15 0.15: 189.49,86.63 188.86,86
  Bottom 0.15: 103.89,94.25 103.85,94.21
S$229
  Top 0.15: 5.02,80.68 11.77,80.68
  Route2 1.2: 153.47,69.03 153.47,70.83
  Route15 0.15: 188.86,86 188.86,79.64
  Bottom 0.15: 87.61,92.98 91.58,92.98
S$230
  Top 0.15: 11.77,80.68 15.3,77.14
  Route2 1.2: 153.47,70.83 153.67,71.03
  Route15 0.15: 188.86,79.64 190.13,78.38
  Bottom 0.15: 91.58,92.98 92.3,92.27
S$231
  Top 0.15: 15.3,77.14 15.3,75.68
  Route2 1.2: 153.77,66.72 153.67,66.72
  Route15 0.15: 190.13,78.38 190.13,77.74
  Bottom 0.15: 92.3,92.27 92.3,91.03
S$232
  Top 0.15: 185.25,92.86 185.25,92.98
  Route2 1.2: 153.67,66.72 153.47,66.53
  Route15 0.15: 190.13,77.74 190.33,77.62
  Bottom 0.15: 92.3,91.03 91.46,90.2
S$233
  Top 0.15: 185.25,92.98 184.25,93.97
  Route2 1.2: 153.47,66.53 153.47,63.62
  Route15 0.15: 192.87,77.62 192.67,77.74
  Bottom 0.15: 91.46,90.2 87.42,90.2
S$234
  Top 0.15: 184.25,93.97 182.23,93.97
  Route2 1.2: 153.47,63.62 153.87,63.23
  Route15 0.15: 192.67,77.74 190.13,77.74
  Bottom 0.15: 87.42,90.2 86.42,89.21
S$235
  Top 0.15: 182.23,93.97 182.19,94.01
  Route2 1.2: 153.67,61.42 153.67,61.33
  Route15 0.15: 190.13,77.74 190.33,77.62
  Bottom 0.15: 86.42,89.21 53.16,89.21
S$236
  Top 0.15: 182.19,94.01 181.47,93.3
  Route2 1.2: 153.67,61.33 153.37,61.02
  Route15 0.15: 190.33,70 190.13,70.12
  Bottom 0.15: 53.16,89.21 51.78,90.6
S$237
  Top 0.15: 181.47,93.3 181.47,89.37
  Route2 1.2: 153.37,61.02 153.37,58.33
  Route15 0.15: 190.13,70.12 188.86,71.39
  Bottom 0.15: 51.78,90.6 48.12,90.6
S$238
  Top 0.15: 181.47,89.37 181.51,89.33
  Route2 1.2: 153.37,58.33 153.77,57.92
  Route15 0.15: 188.86,71.39 188.86,75.83
  Bottom 0.15: 48.12,90.6 39.83,82.3
S$239
  Top 0.15: 181.51,89.33 181.51,89.29
  Route2 1.2: 153.77,56.33 153.27,55.83
  Route15 0.15: 188.86,75.83 190.13,77.11
  Bottom 0.15: 39.83,82.3 39.83,81.79
S$240
  Top 0.15: 181.51,89.29 181.12,88.89
  Route2 1.2: 153.27,55.83 153.27,53.52
  Route15 0.15: 190.13,77.11 190.13,77.74
  Bottom 0.15: 39.83,81.79 39.35,81.31
S$241
  Top 0.15: 181.12,88.89 170.04,88.89
  Route2 1.2: 153.27,53.52 154.09,52.71
  Route15 0.15: 190.13,77.74 190.33,77.62
  Bottom 0.15: 39.35,81.31 18.95,81.31
S$242
  Top 0.15: 170.04,88.89 169.93,88.77
  Route2 1.2: 155.57,53.02 155.57,53.23
  Route15 0.15: 190.33,67.46 190.13,67.58
  Bottom 0.15: 18.95,81.31 18.95,81.43
S$243
  Top 0.15: 169.93,88.77 169.93,88.81
  Route2 1.2: 155.57,53.23 156.03,53.37
  Route15 0.15: 190.13,67.58 190.13,70.12
  Bottom 0.15: 18.95,81.43 16.61,83.77
S$244
  Top 0.15: 169.93,88.81 168.5,90.24
  Route2 1.2: 156.03,53.37 158.57,53.52
  Route15 0.15: 190.13,70.12 190.33,70
  Bottom 0.15: 181.08,94.81 181.08,95.04
S$245
  Top 0.15: 168.5,90.24 168.5,93.34
  Route2 1.2: 158.57,53.52 159.27,52.83
  Route15 0.15: 192.87,64.92 192.67,65.04
  Bottom 0.15: 181.08,95.04 180.6,95.52
S$246
  Top 0.15: 168.5,93.34 167.07,94.77
  Route2 1.2: 160.47,52.92 160.67,52.92
  Route15 0.15: 192.67,65.04 190.13,67.58
  Bottom 0.15: 180.6,95.52 21.06,95.52
S$247
  Top 0.15: 167.07,94.77 148.41,94.77
  Route2 1.2: 160.67,52.92 161.07,53.33
  Route15 0.15: 190.13,67.58 190.33,67.46
  Bottom 0.15: 21.06,95.52 19.11,93.58
S$248
  Top 0.15: 148.41,94.77 148.41,94.69
  Route2 1.2: 161.07,53.33 164.17,53.33
  Route15 0.15: 185.25,54.76 185.05,54.88
  Bottom 0.15: 180.16,92.86 180.16,93.46
S$249
  Top 0.15: 148.41,94.69 146.11,92.39
  Route2 1.2: 164.17,53.33 164.57,52.92
  Route15 0.15: 185.05,54.88 188.86,58.69
  Bottom 0.15: 180.16,93.46 178.58,95.04
S$250
  Top 0.15: 146.11,92.39 146.11,91.23
  Route2 1.2: 164.57,52.92 164.57,53.42
  Route15 0.15: 188.86,58.69 188.86,65.67
  Bottom 0.15: 178.58,95.04 21.97,95.04
S$251
  Top 0.15: 146.11,91.23 146.15,91.19
  Route2 1.2: 164.57,53.42 164.93,53.94
  Route15 0.15: 188.86,65.67 190.13,66.94
  Bottom 0.15: 21.97,95.04 20.7,93.77
S$252
  Top 0.15: 31.3,92.34 31.3,92.31
  Route2 1.2: 164.87,53.83 164.97,53.83
  Route15 0.15: 190.13,66.94 190.13,67.58
  Bottom 0.15: 20.7,93.77 20.7,93.58
S$253
  Top 0.15: 31.3,92.31 30.9,91.91
  Route2 1.2: 164.97,53.83 165.27,53.52
  Route15 0.15: 190.13,67.58 190.33,67.46
  Bottom 0.15: 20.7,93.58 20.86,93.42
S$254
  Top 0.15: 30.9,91.91 27.77,91.91
  Route2 1.2: 165.27,53.52 169.47,53.52
  Route15 0.15: 192.94,54.84 192.67,54.88
  Bottom 0.15: 182.71,92.86 182.71,95
S$255
  Top 0.15: 27.77,91.91 27.25,92.42
  Route2 1.2: 169.47,53.52 169.97,54.02
  Route15 0.15: 192.67,54.88 191.4,56.15
  Bottom 0.15: 182.71,95 181.79,95.92
S$256
  Top 0.15: 27.25,92.42 27.25,93.38
  Route2 1.2: 170.57,54.12 170.87,54.12
  Route15 0.15: 191.4,56.15 186.95,56.15
  Bottom 0.15: 181.79,95.92 7.92,95.92
S$257
  Top 0.15: 27.25,93.38 26.57,94.05
  Route2 1.2: 170.87,54.12 172.27,52.73
  Route15 0.15: 186.95,56.15 185.68,54.88
  Bottom 0.15: 7.92,95.92 5.02,93.02
S$258
  Top 0.15: 26.57,94.05 25.27,94.05
  Route2 1.2: 173.17,52.52 173.04,52.52
  Route15 0.15: 185.68,54.88 185.05,54.88
  Bottom 0.15: 5.02,93.02 5.02,80.68
S$259
  Top 0.15: 25.27,94.05 24.99,93.77
  Route2 1.2: 173.04,52.52 175.29,54.62
  Route15 0.15: 185.05,54.88 185.25,54.76
  Bottom 0.15: 146.11,91.23 133.85,91.23
S$260
  Top 0.15: 24.99,93.77 24.99,89.61
  Route2 1.2: 175.38,55.08 176.33,53.38
  Route15 0.15: 185.25,52.22 185.05,52.34
  Bottom 0.15: 133.85,91.23 133.29,90.68
S$261
  Top 0.15: 190.76,95.44 191.04,95.44
  Route2 1.2: 176.33,53.38 177.27,52.12
  Route15 0.15: 185.05,52.34 185.05,54.88
  Bottom 0.15: 133.29,90.68 131.39,90.68
S$262
  Top 0.15: 191.04,95.44 191.24,95.64
  Route2 1.2: 178.37,52.33 178.57,52.33
  Route15 0.15: 185.05,54.88 185.25,54.76
  Bottom 0.15: 131.39,90.68 131.19,90.88
S$263
  Top 0.15: 191.24,95.64 203.14,95.64
  Route2 1.2: 178.57,52.33 180.27,54.02
  Route15 0.15: 185.25,54.76 185.05,54.88
  Bottom 0.15: 131.19,90.88 126.79,90.88
S$264
  Top 0.15: 203.14,95.64 205.65,93.14
  Route2 1.2: 180.37,54.52 182.97,54.52
  Route15 0.15: 185.05,54.88 183.78,56.15
  Bottom 0.15: 126.79,90.88 126.27,91.39
S$265
  Top 0.15: 205.65,93.14 205.65,83.97
  Route2 1.2: 183.17,54.42 183.17,52.12
  Route15 0.15: 183.78,56.15 179.33,56.15
  Bottom 0.15: 126.27,91.39 121.75,91.39
S$266
  Top 0.15: 205.65,83.97 204.41,82.74
  Route2 1.2: 183.17,52.12 183.07,52.02
  Route15 0.15: 179.33,56.15 178.06,54.88
  Bottom 0.15: 121.75,91.39 121.23,90.88
S$267
  Top 0.15: 204.41,82.74 204.41,71.39
  Route2 1.2: 183.17,51.62 183.57,51.62
  Route15 0.15: 178.06,54.88 177.43,54.88
  Bottom 0.15: 121.23,90.88 117.18,90.88
S$268
  Top 0.15: 204.41,71.39 202.99,69.96
  Route2 1.2: 183.57,51.62 184.17,51.02
  Route15 0.15: 177.43,54.88 177.62,54.76
  Bottom 0.15: 117.18,90.88 116.67,91.39
S$269
  Top 0.15: 152.22,90.32 152.22,90.56
  Route2 1.2: 184.17,51.02 187.27,51.02
  Route15 0.15: 175.09,52.22 174.89,52.34
  Bottom 0.15: 116.67,91.39 108.09,91.39
S$270
  Top 0.15: 152.22,90.56 152.98,91.31
  Route2 1.2: 187.27,51.02 187.77,51.52
  Route15 0.15: 174.89,52.34 177.43,54.88
  Bottom 0.15: 108.09,91.39 107.81,91.11
S$271
  Top 0.15: 152.98,91.31 163.1,91.31
  Route2 1.2: 188.27,51.42 188.27,51.33
  Route15 0.15: 177.43,54.88 177.62,54.76
  Bottom 0.15: 107.81,91.11 103.61,91.11
S$272
  Top 0.15: 163.1,91.31 163.26,91.15
  Route2 1.2: 188.27,51.33 188.77,50.83
  Route15 0.15: 175.09,52.22 174.89,52.34
  Bottom 0.15: 103.61,91.11 103.01,91.71
S$273
  Top 0.15: 163.26,91.15 163.26,85.52
  Route2 1.2: 188.77,50.83 191.77,50.83